# EAGLE board quantum_AnalougeEngine_V4_0 (EAGLE 9.5.2)
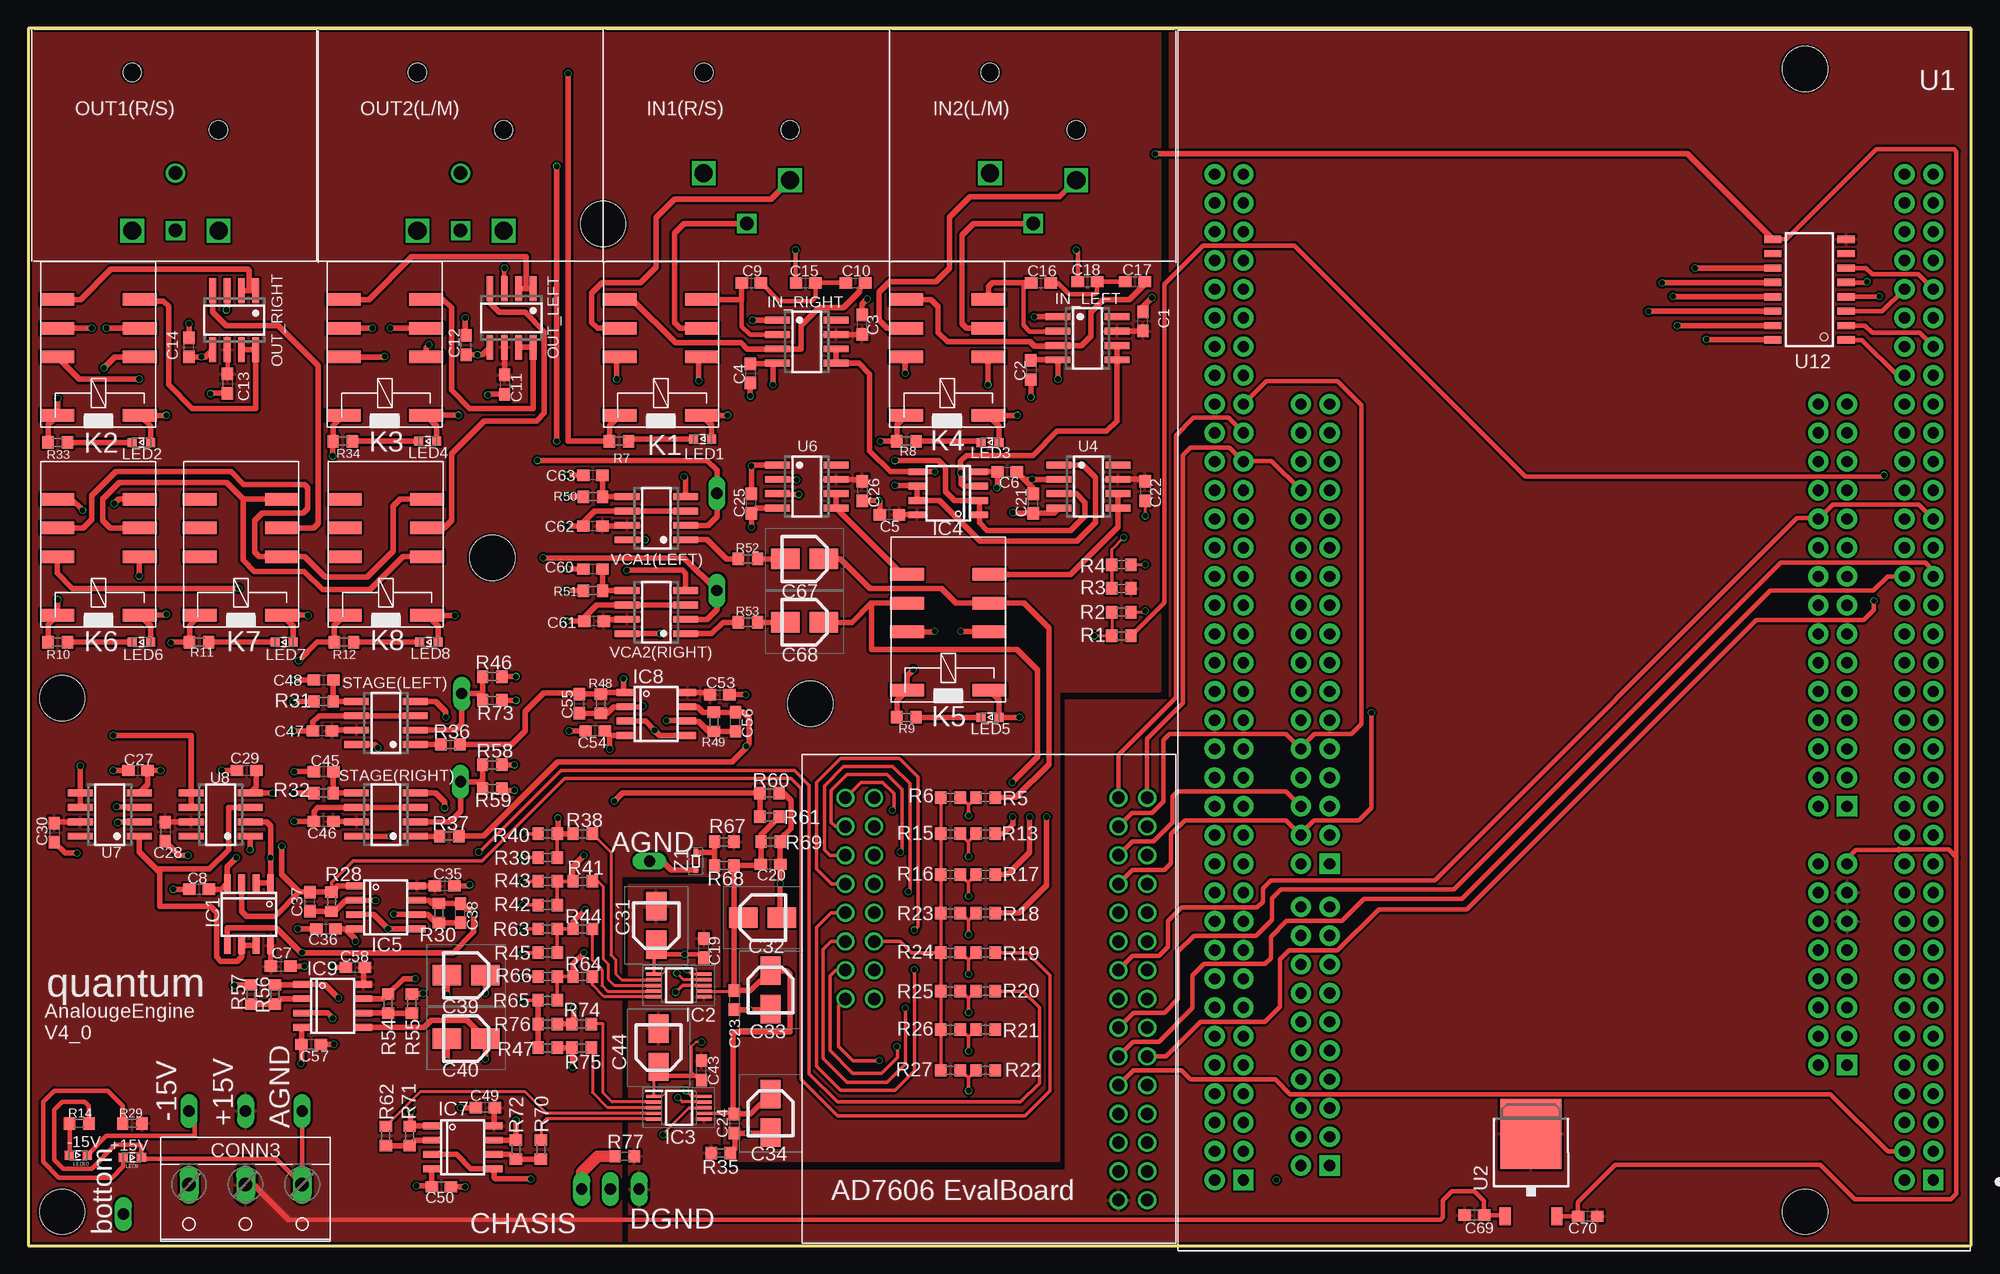
[diagram p11: board, top side]
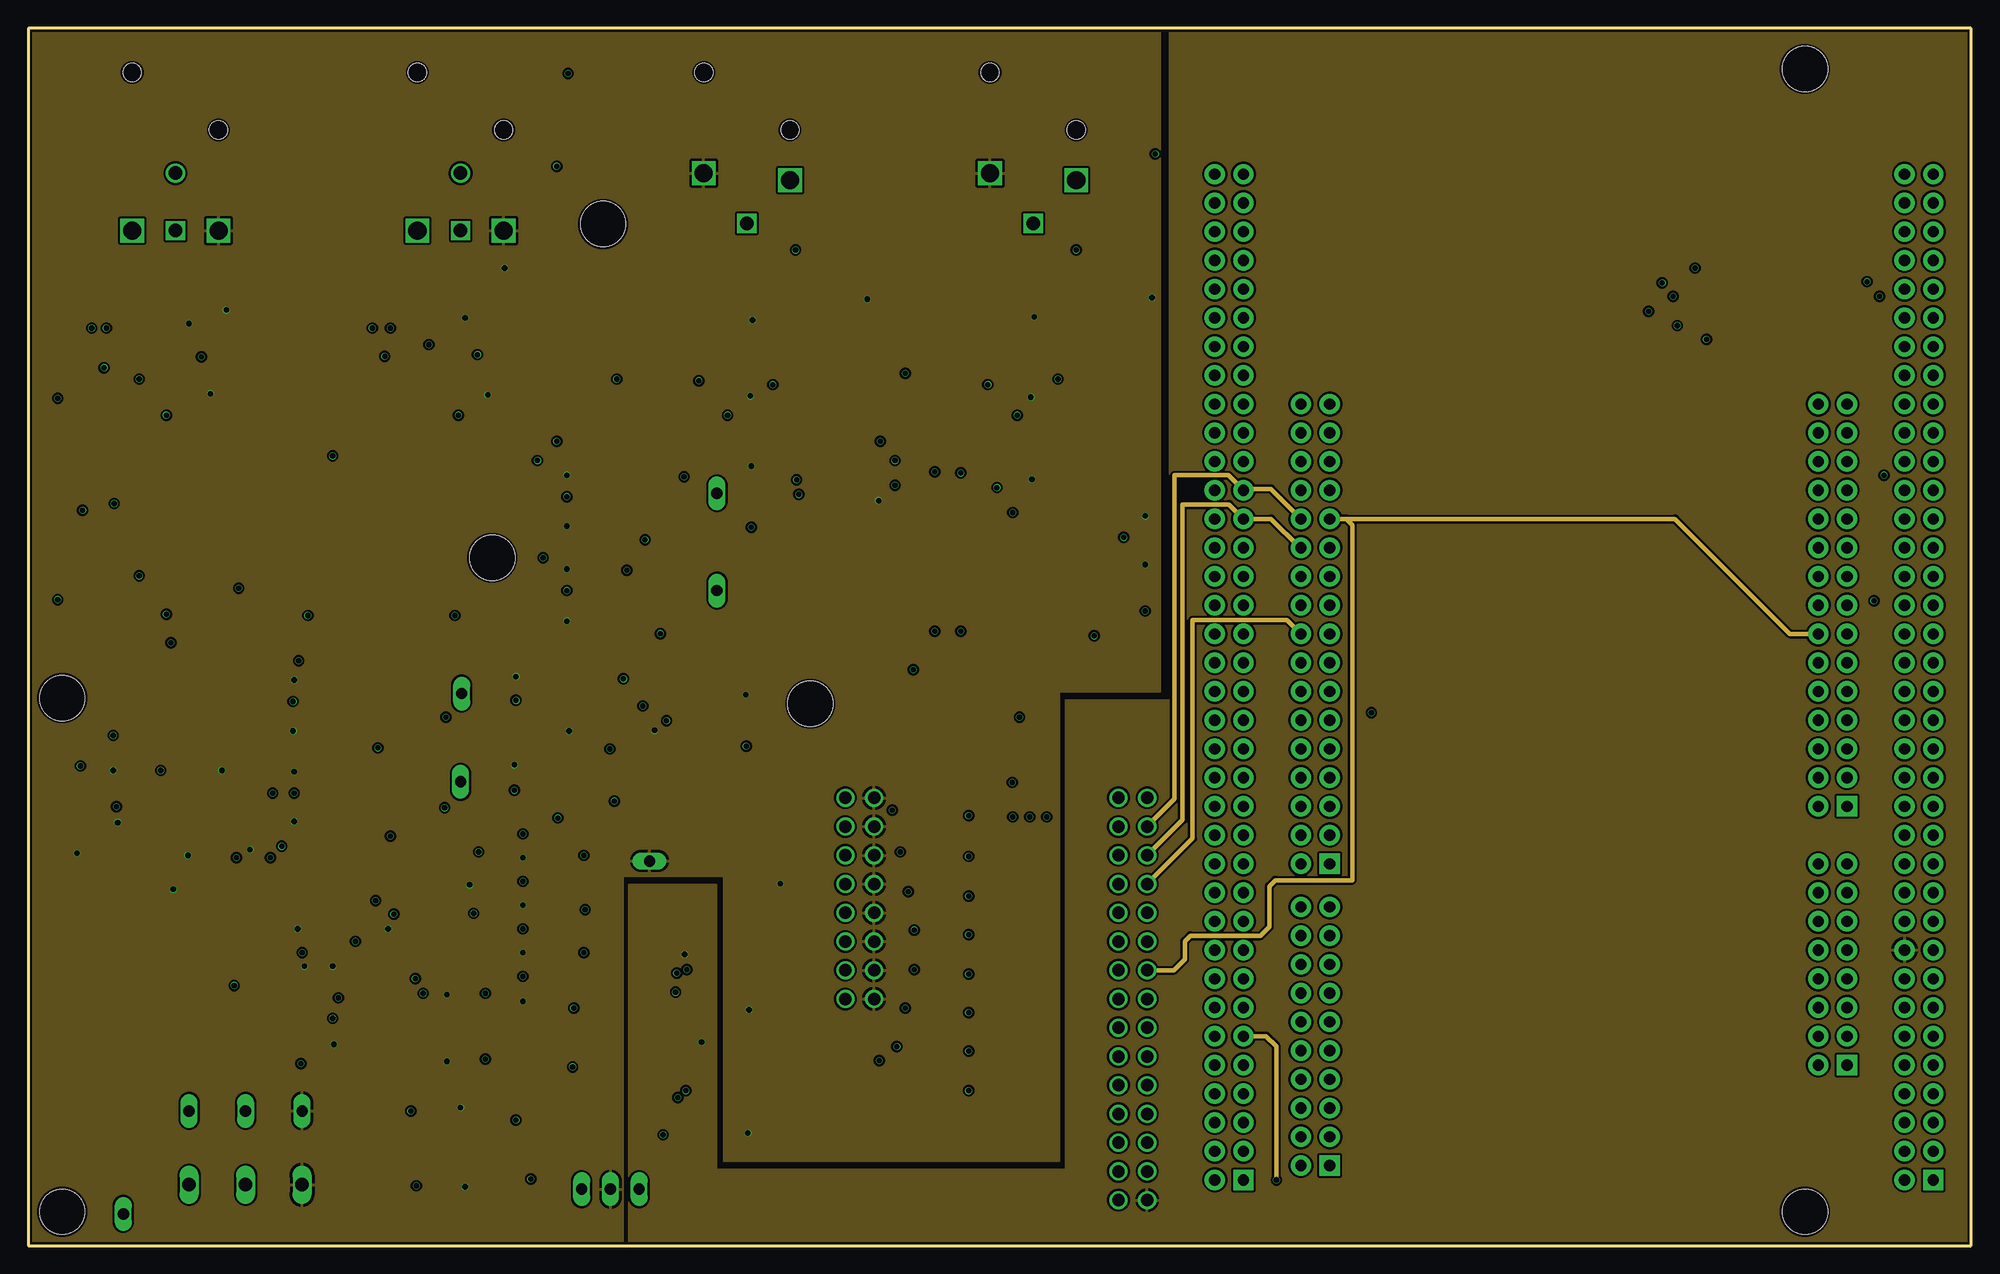
[diagram p12: board, inner layer midTop(AGND)]
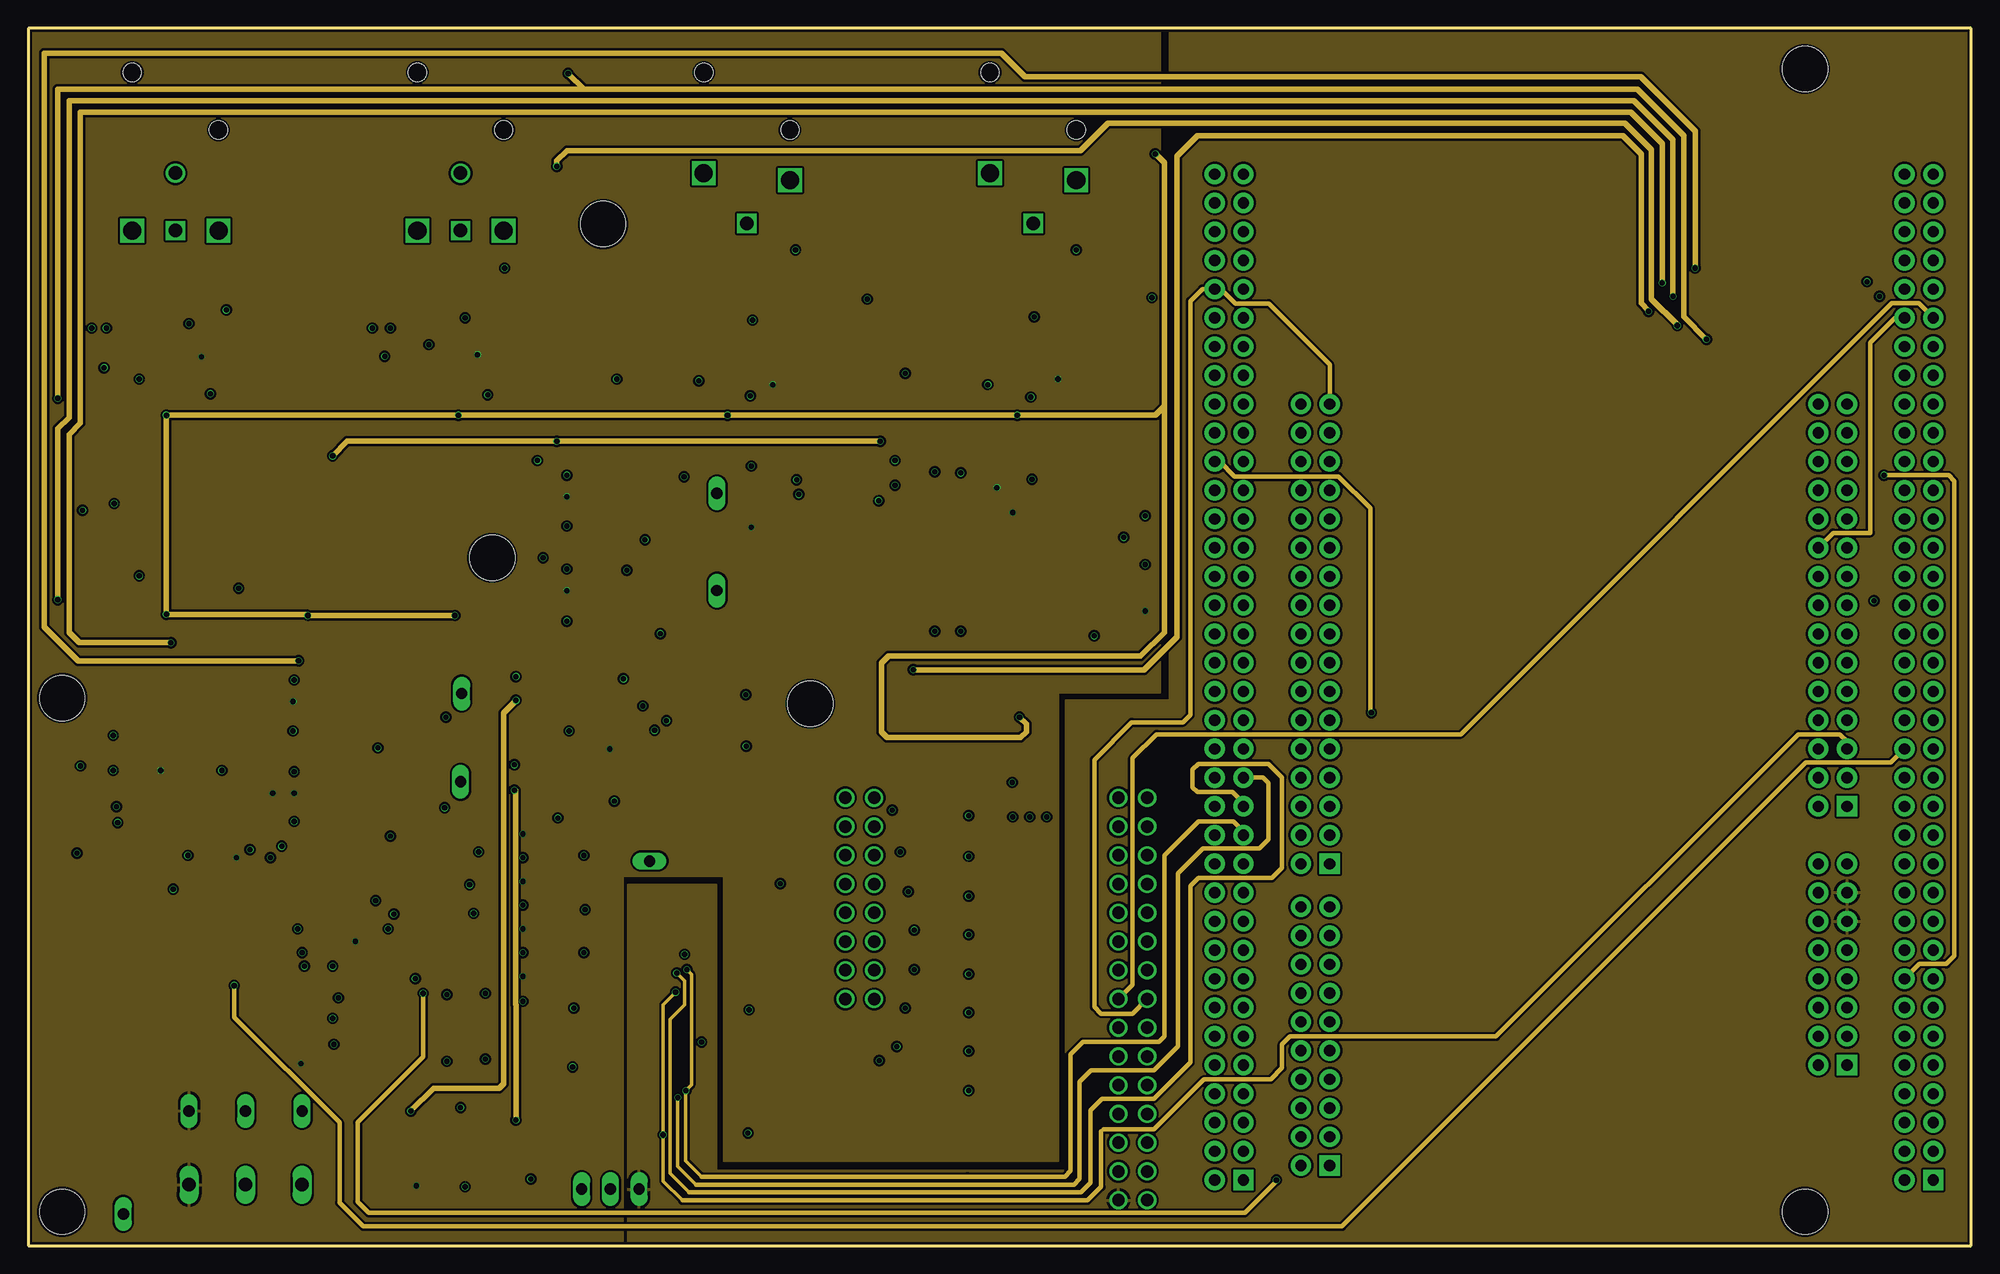
[diagram p13: board, inner layer midBottom(V-)]
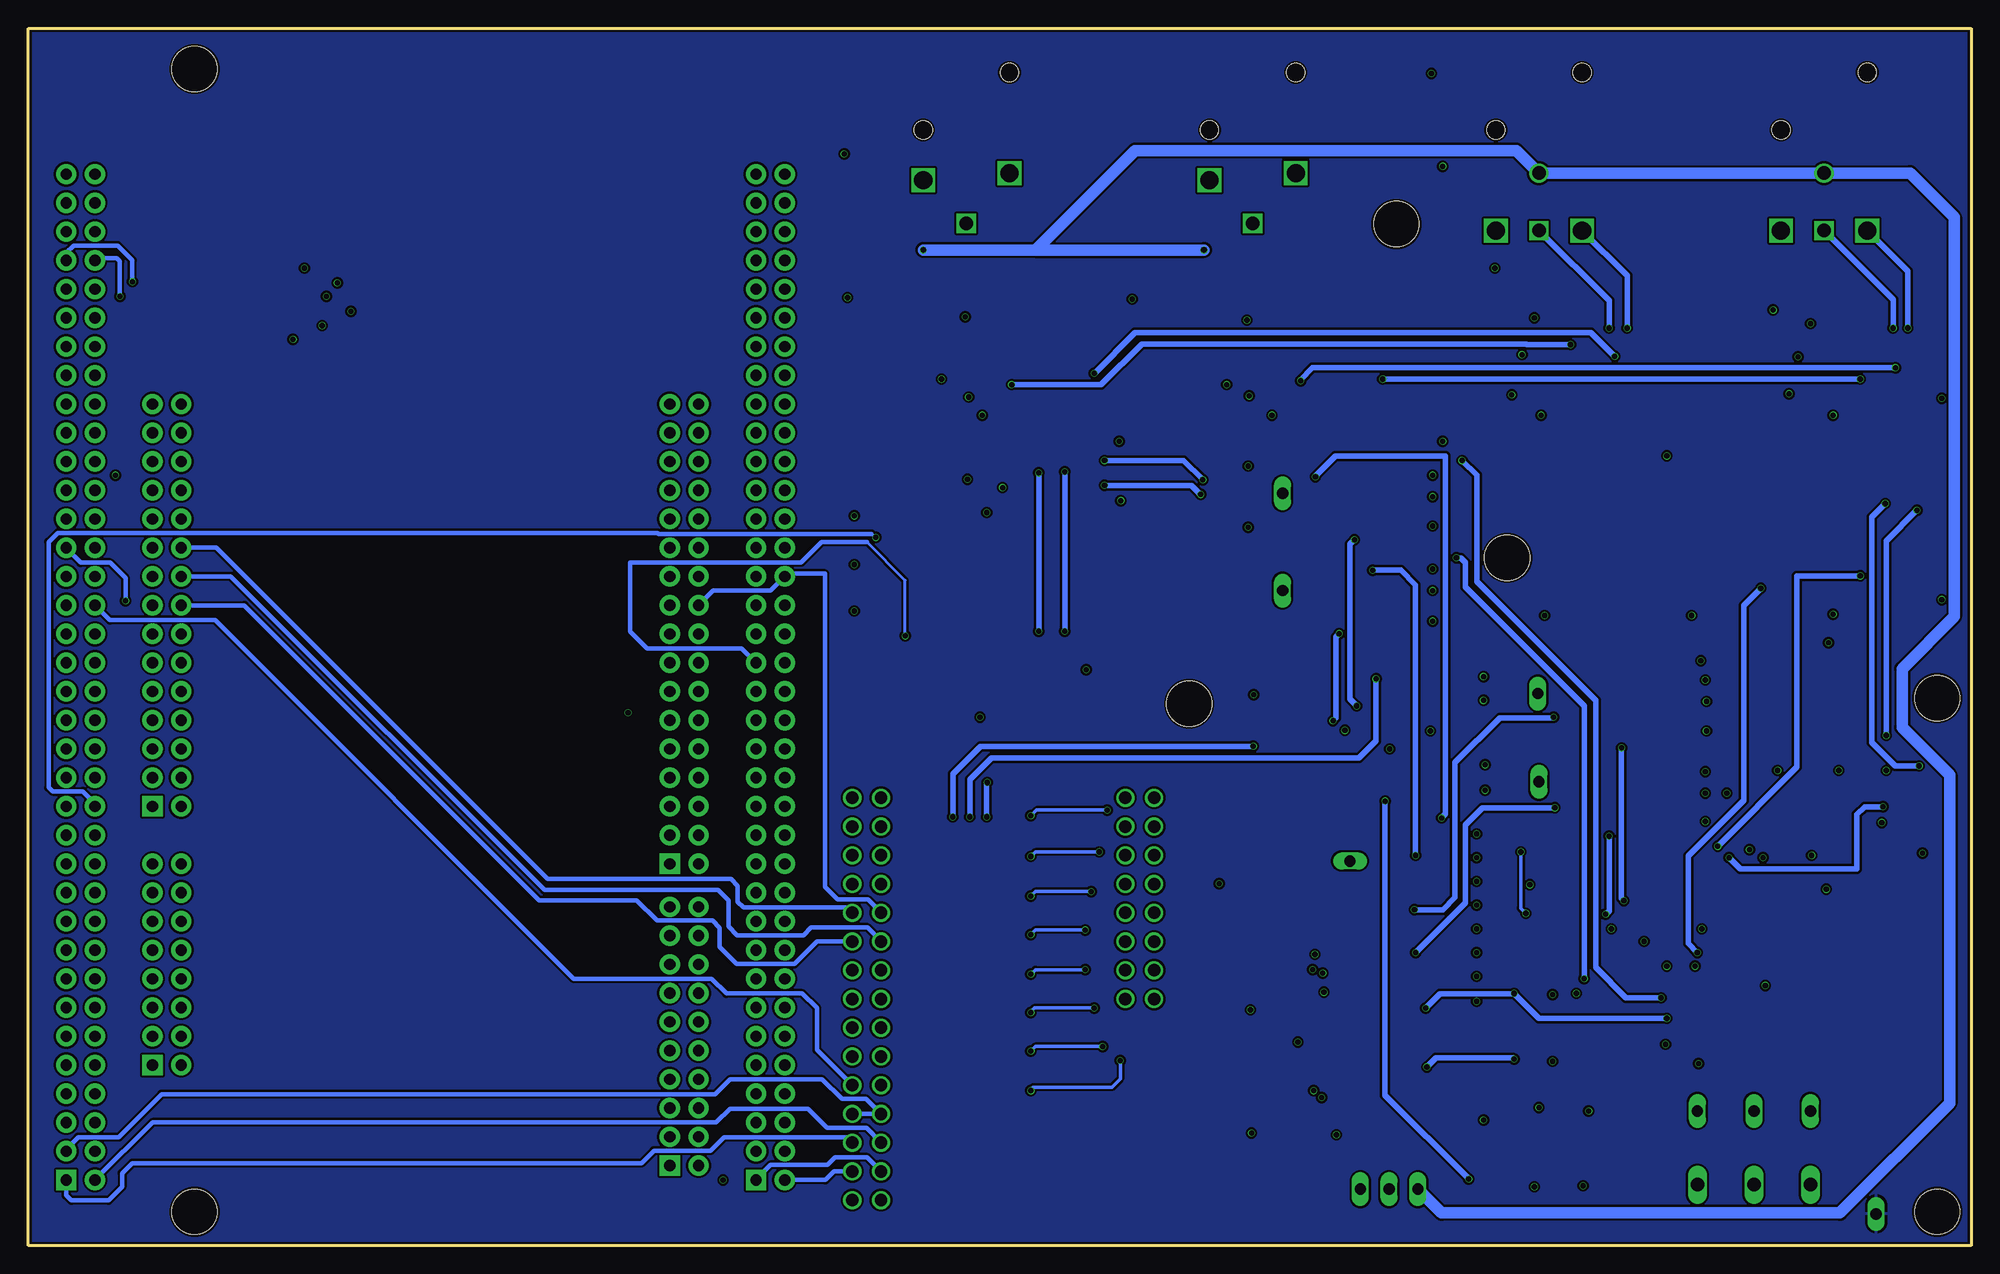
[diagram p14: board, bottom side, seen from below]

Size 171.7 x 107.6 mm. Coordinates in mm from the lower left corner, seen from the top.
Outline: 0,0 171.7,0 171.7,107.6 0,107.6 0,0
Copper layers (1*2+15*16): Top(V+) 0.018mm / dielectric 0.362mm / midTop(AGND) 0.035mm / dielectric 0.71mm / midBottom(V-) 0.035mm / dielectric 0.362mm / Bottom 0.018mm
Design rules "4layer": minimum track width 0.2mm, minimum drill 0.2mm, track to track 0.2mm, track to pad 0.1mm, pad to pad 0.1mm, via to via 0.1mm, smd to smd 0.1mm, copper to edge 0.2mm, drill to drill 0.21mm, minimum pad ring 0.25mm, minimum via ring 0.05mm, stop-mask expansion 0.01mm, vias tented up to drill 0mil, thermal gap 10mil
Holes 4 mm at 3,3 157,3 69.1,47.9 157,104 50.8,90.3 41,60.8 3,48.4

## Footprints (pad centres in the part's own frame; a part is rotated, then mirrored left to right if it is on the bottom)
C0603 = smd 1.1 x 1: 1 -0.85,0; 2 0.85,0
CAPAE400X550N = smd 2.5 x 1.8: 1 -1.7,0; 2 1.7,0
W237-103 = drill 1.194 long: 1 -5,-1.29; 2 0,-1.29; 3 5,-1.29
SOIC8 = smd 0.6 x 1.5: 1 -1.905,-2.75; 2 -0.635,-2.75; 3 0.635,-2.75; 4 1.905,-2.75; 5 1.905,2.75; 6 0.635,2.75; 7 -0.635,2.75; 8 -1.905,2.75
SOP50P490X110-10N = smd 1.4 x 0.3: 1 -2.2,1; 2 -2.2,0.5; 3 -2.2,0; 4 -2.2,-0.5; 5 -2.2,-1; 6 2.2,-1; 7 2.2,-0.5; 8 2.2,0; 9 2.2,0.5; 10 2.2,1
NEUTRIK_NC3FAH = drill 1.6 square: 1 -3.81,-12.7; 2 3.81,-13.335 | drill 1.2 square: 3 0,-17.15 | hole 1.6: -3.81,-3.81; 3.81,-8.89
SO08 = smd 0.6 x 2.2: 1 -1.905,-2.6; 2 -0.635,-2.6; 3 0.635,-2.6; 4 1.905,-2.6; 5 1.905,2.6; 6 0.635,2.6; 7 -0.635,2.6; 8 -1.905,2.6
351 = smd 1.11 x 3: 1 -2.623,-3.645; 2 -2.623,3.645; P1 5.096,-3.645; P2 5.096,3.645; Q1 2.556,-3.645; Q2 2.556,3.645; S1 7.636,-3.645; S2 7.636,3.645
WL-SMCW_0603 = smd 0.8 x 0.8: 1 -0.8,0; 2 0.8,0
NEUTRIK_NC3MAH = drill 1.6 square: 1 3.81,-17.78; 2 -3.81,-17.78 | drill 1.2 square: 3 0,-17.78 | drill 1.2: G 0,-12.7 | hole 1.6: -3.81,-3.8; 3.81,-8.89
R0603 = smd 1 x 1.1: 1 -0.85,0; 2 0.85,0
THT_PIN = drill 1 long: P$1 0,0
MODULE_NUCLEO-F429ZI = drill 1 pad 1.8 square: CN7_1 21.59,43.82; CN8_1 -24.13,34.93; CN9_1 -24.13,12.07; CN10_1 21.59,17.15; CN11_1 -31.75,45.09; CN12_1 29.21,45.09 | drill 1 pad 1.8: CN7_2 24.13,43.82; CN7_3 21.59,41.28; CN7_4 24.13,41.28; CN7_5 21.59,38.74; CN7_6 24.13,38.74; CN7_7 21.59,36.2; CN7_8 24.13,36.2; CN7_9 21.59,33.66; CN7_10 24.13,33.66; CN7_11 21.59,31.12; CN7_12 24.13,31.12; CN7_13 21.59,28.58; CN7_14 24.13,28.58; CN7_15 21.59,26.04; CN7_16 24.13,26.04; CN7_17 21.59,23.5; CN7_18 24.13,23.5; CN7_19 21.59,20.96; CN7_20 24.13,20.96; CN8_2 -21.59,34.93; CN8_3 -24.13,32.39; CN8_4 -21.59,32.39; CN8_5 -24.13,29.85; CN8_6 -21.59,29.85; CN8_7 -24.13,27.31; CN8_8 -21.59,27.31; CN8_9 -24.13,24.77; CN8_10 -21.59,24.77; CN8_11 -24.13,22.23; CN8_12 -21.59,22.23; CN8_13 -24.13,19.69; CN8_14 -21.59,19.69; CN8_15 -24.13,17.15; CN8_16 -21.59,17.15; CN9_2 -21.59,12.07; CN9_3 -24.13,9.53; CN9_4 -21.59,9.53; CN9_5 -24.13,6.99; CN9_6 -21.59,6.99; CN9_7 -24.13,4.45; CN9_8 -21.59,4.45; CN9_9 -24.13,1.91; CN9_10 -21.59,1.91; CN9_11 -24.13,-0.63; CN9_12 -21.59,-0.63; CN9_13 -24.13,-3.17; CN9_14 -21.59,-3.17; CN9_15 -24.13,-5.71; CN9_16 -21.59,-5.71; CN9_17 -24.13,-8.25; CN9_18 -21.59,-8.25; CN9_19 -24.13,-10.79; CN9_20 -21.59,-10.79; CN9_21 -24.13,-13.33; CN9_22 -21.59,-13.33; CN9_23 -24.13,-15.87; CN9_24 -21.59,-15.87; CN9_25 -24.13,-18.41; CN9_26 -21.59,-18.41; CN9_27 -24.13,-20.95; CN9_28 -21.59,-20.95; CN9_29 -24.13,-23.49; CN9_30 -21.59,-23.49; CN10_2 24.13,17.15; CN10_3 21.59,14.61; CN10_4 24.13,14.61; CN10_5 21.59,12.07; CN10_6 24.13,12.07; CN10_7 21.59,9.53; CN10_8 24.13,9.53; CN10_9 21.59,6.99; CN10_10 24.13,6.99; CN10_11 21.59,4.45; CN10_12 24.13,4.45; CN10_13 21.59,1.91; CN10_14 24.13,1.91; CN10_15 21.59,-0.63; CN10_16 24.13,-0.63; CN10_17 21.59,-3.17; CN10_18 24.13,-3.17; CN10_19 21.59,-5.71; CN10_20 24.13,-5.71; CN10_21 21.59,-8.25; CN10_22 24.13,-8.25; CN10_23 21.59,-10.79; CN10_24 24.13,-10.79; CN10_25 21.59,-13.33; CN10_26 24.13,-13.33; CN10_27 21.59,-15.87; CN10_28 24.13,-15.87; CN10_29 21.59,-18.41; CN10_30 24.13,-18.41; CN10_31 21.59,-20.95; CN10_32 24.13,-20.95; CN10_33 21.59,-23.49; CN10_34 24.13,-23.49; CN11_2 -29.21,45.09; CN11_3 -31.75,42.55; CN11_4 -29.21,42.55; CN11_5 -31.75,40.01; CN11_6 -29.21,40.01; CN11_7 -31.75,37.47; CN11_8 -29.21,37.47; CN11_9 -31.75,34.93; CN11_10 -29.21,34.93; CN11_11 -31.75,32.39; CN11_12 -29.21,32.39; CN11_13 -31.75,29.85; CN11_14 -29.21,29.85; CN11_15 -31.75,27.31; CN11_16 -29.21,27.31; CN11_17 -31.75,24.77; CN11_18 -29.21,24.77; CN11_19 -31.75,22.23; CN11_20 -29.21,22.23; CN11_21 -31.75,19.69; CN11_22 -29.21,19.69; CN11_23 -31.75,17.15; CN11_24 -29.21,17.15; CN11_25 -31.75,14.61; CN11_26 -29.21,14.61; CN11_27 -31.75,12.07; CN11_28 -29.21,12.07; CN11_29 -31.75,9.53; CN11_30 -29.21,9.53; CN11_31 -31.75,6.99; CN11_32 -29.21,6.99; CN11_33 -31.75,4.45; CN11_34 -29.21,4.45; CN11_35 -31.75,1.91; CN11_36 -29.21,1.91; CN11_37 -31.75,-0.63; CN11_38 -29.21,-0.63; CN11_39 -31.75,-3.17; CN11_40 -29.21,-3.17; CN11_41 -31.75,-5.71; CN11_42 -29.21,-5.71; CN11_43 -31.75,-8.25; CN11_44 -29.21,-8.25; CN11_45 -31.75,-10.79; CN11_46 -29.21,-10.79; CN11_47 -31.75,-13.33; CN11_48 -29.21,-13.33; CN11_49 -31.75,-15.87; CN11_50 -29.21,-15.87; CN11_51 -31.75,-18.41; CN11_52 -29.21,-18.41; CN11_53 -31.75,-20.95; CN11_54 -29.21,-20.95; CN11_55 -31.75,-23.49; CN11_56 -29.21,-23.49; CN11_57 -31.75,-26.03; CN11_58 -29.21,-26.03; CN11_59 -31.75,-28.57; CN11_60 -29.21,-28.57; CN11_61 -31.75,-31.11; CN11_62 -29.21,-31.11; CN11_63 -31.75,-33.65; CN11_64 -29.21,-33.65; CN11_65 -31.75,-36.19; CN11_66 -29.21,-36.19; CN11_67 -31.75,-38.73; CN11_68 -29.21,-38.73; CN11_69 -31.75,-41.27; CN11_70 -29.21,-41.27; CN11_71 -31.75,-43.81; CN11_72 -29.21,-43.81; CN12_2 31.75,45.09; CN12_3 29.21,42.55; CN12_4 31.75,42.55; CN12_5 29.21,40.01; CN12_6 31.75,40.01; CN12_7 29.21,37.47; CN12_8 31.75,37.47; CN12_9 29.21,34.93; CN12_10 31.75,34.93; CN12_11 29.21,32.39; CN12_12 31.75,32.39; CN12_13 29.21,29.85; CN12_14 31.75,29.85; CN12_15 29.21,27.31; CN12_16 31.75,27.31; CN12_17 29.21,24.77; CN12_18 31.75,24.77; CN12_19 29.21,22.23; CN12_20 31.75,22.23; CN12_21 29.21,19.69; CN12_22 31.75,19.69; CN12_23 29.21,17.15; CN12_24 31.75,17.15; CN12_25 29.21,14.61; CN12_26 31.75,14.61; CN12_27 29.21,12.07; CN12_28 31.75,12.07; CN12_29 29.21,9.53; CN12_30 31.75,9.53; CN12_31 29.21,6.99; CN12_32 31.75,6.99; CN12_33 29.21,4.45; CN12_34 31.75,4.45; CN12_35 29.21,1.91; CN12_36 31.75,1.91; CN12_37 29.21,-0.63; CN12_38 31.75,-0.63; CN12_39 29.21,-3.17; CN12_40 31.75,-3.17; CN12_41 29.21,-5.71; CN12_42 31.75,-5.71; CN12_43 29.21,-8.25; CN12_44 31.75,-8.25; CN12_45 29.21,-10.79; CN12_46 31.75,-10.79; CN12_47 29.21,-13.33; CN12_48 31.75,-13.33; CN12_49 29.21,-15.87; CN12_50 31.75,-15.87; CN12_51 29.21,-18.41; CN12_52 31.75,-18.41; CN12_53 29.21,-20.95; CN12_54 31.75,-20.95; CN12_55 29.21,-23.49; CN12_56 31.75,-23.49; CN12_57 29.21,-26.03; CN12_58 31.75,-26.03; CN12_59 29.21,-28.57; CN12_60 31.75,-28.57; CN12_61 29.21,-31.11; CN12_62 31.75,-31.11; CN12_63 29.21,-33.65; CN12_64 31.75,-33.65; CN12_65 29.21,-36.19; CN12_66 31.75,-36.19; CN12_67 29.21,-38.73; CN12_68 31.75,-38.73; CN12_69 29.21,-41.27; CN12_70 31.75,-41.27; CN12_71 29.21,-43.81; CN12_72 31.75,-43.81
TO252 = smd 1 x 1.6: 1 -2.28,-4.8; 3 2.28,-4.8 | smd 5.4 x 6.2: 2 0,2.5
AD7606_EVALBOARD = drill 1.1: +5V 30.48,-39.37; BUSY 27.94,-26.67; CS 30.48,-26.67; CVA 30.48,-31.75; CVB 27.94,-31.75; DB0 30.48,-21.59; DB1 27.94,-21.59; DB2 30.48,-19.05; DB3 27.94,-19.05; DB4 30.48,-16.51; DB5 27.94,-16.51; DB6 30.48,-13.97; DB7 27.94,-13.97; DB8 30.48,-11.43; DB9 27.94,-11.43; DB10 30.48,-8.89; DB11 27.94,-8.89; DB12 30.48,-6.35; DB13 27.94,-6.35; DB14 30.48,-3.81; DB15 27.94,-3.81; FRST 27.94,-24.13; G1 6.35,-3.81; G2 6.35,-6.35; G3 6.35,-8.89; G4 6.35,-11.43; G5 6.35,-13.97; G6 6.35,-16.51; G7 6.35,-19.05; G8 6.35,-21.59; GND 27.94,-39.37; OS0 30.48,-36.83; OS1 27.94,-36.83; OS2 30.48,-34.29; RANGE 27.94,-34.29; RD 27.94,-29.21; RST 30.48,-29.21; V1 3.81,-3.81; V2 3.81,-6.35; V3 3.81,-8.89; V4 3.81,-11.43; V5 3.81,-13.97; V6 3.81,-16.51; V7 3.81,-19.05; V8 3.81,-21.59; VIO 30.48,-24.13
SOIC16 = smd 1.524 x 0.635: 1 -3.24,4.445; 2 -3.24,3.175; 3 -3.24,1.905; 4 -3.24,0.635; 5 -3.24,-0.635; 6 -3.24,-1.905; 7 -3.24,-3.175; 8 -3.24,-4.445; 9 3.24,-4.445; 10 3.24,-3.175; 11 3.24,-1.905; 12 3.24,-0.635; 13 3.24,0.635; 14 3.24,1.905; 15 3.24,3.175; 16 3.24,4.445
SODFL1608X65N = smd 0.57 x 0.42: 1 -0.775,0; 2 0.775,0

## Placement (x,y rotation side)
C1  100nF  [C0603]  98.5,81.7 90 top
C2  100nF  [C0603]  88.6,77.4 270 top
C3  100nF  [C0603]  73.7,81.4 90 top
C4  100nF  [C0603]  63.8,77.1 270 top
C5  100nF  [C0603]  76.1,64.6 180 top
C6  100nF  [C0603]  86.5,68.4 0 top
C7  100nF  [C0603]  22.3,24.7 0 top
C8  100nF  [C0603]  15.1,31.5 180 top
C9  470 pF  [C0603]  63.9,85.1 0 top
C10  470 pF  [C0603]  73.1,85.1 0 top
C11  100nF  [C0603]  42.1,76.1 270 top
C12  100nF  [C0603]  38.7,79.6 90 top
C13  100nF  [C0603]  17.6,76.2 270 top
C14  100nF  [C0603]  14.2,79.4 90 top
C15  47 pF  [C0603]  68.7,85.1 0 top
C16  470 pF  [C0603]  89.5,85.1 0 top
C17  470 pF  [C0603]  97.8,85.2 0 top
C18  47 pF  [C0603]  93.6,85.2 0 top
C19  100nF  [C0603]  59.7,26.3 90 top
C20  100nF  [C0603]  65.6,33.7 0 top
C21  100nF  [C0603]  88.8,65.6 90 top
C22  100nF  [C0603]  98.7,66.7 270 top
C23  100nF  [C0603]  62.4,21.7 270 top
C24  100nF  [C0603]  62.4,10.8 270 top
C25  100nF  [C0603]  63.9,65.6 90 top
C26  100nF  [C0603]  73.7,66.7 270 top
C27  100nF  [C0603]  9.7,42 180 top
C28  100nF  [C0603]  12.1,36.6 270 top
C29  100nF  [C0603]  19.3,42 180 top
C30  100nF  [C0603]  2.3,36.5 270 top
C31  10 µF  [CAPAE400X550N]  55.5,28.3 90 top
C32  10 µF  [CAPAE400X550N]  64.9,29 0 top
C33  10 µF  [CAPAE400X550N]  65.6,22.6 270 top
C34  10 µF  [CAPAE400X550N]  65.6,11.7 270 top
C35  100nF  [C0603]  36.8,31.8 0 top
C36  100nF  [C0603]  26.3,28 180 top
C37  22pF  [C0603]  24.9,30.4 90 top
C38  22pF  [C0603]  38.2,29.4 90 top
C39  10 µF  [CAPAE400X550N]  38.7,23.9 180 top
C40  10 µF  [CAPAE400X550N]  38.7,18.3 180 top
C43  100nF  [C0603]  59.5,15.5 90 top
C44  10 µF  [CAPAE400X550N]  55.7,17.5 90 top
C45  100nF  [C0603]  26.1,41.9 180 top
C46  100nF  [C0603]  26.1,37.5 180 top
C47  100nF  [C0603]  26,45.5 180 top
C48  100nF  [C0603]  26.1,50 180 top
C49  100nF  [C0603]  40.4,12.2 180 top
C50  100nF  [C0603]  36.5,5.2 0 top
C53  100nF  [C0603]  61.1,48.7 0 top
C54  100nF  [C0603]  50.1,45.5 180 top
C55  22pF  [C0603]  48.7,47.9 90 top
C56  22pF  [C0603]  62.5,46.3 90 top
C57  100nF  [C0603]  25,17.8 0 top
C58  100nF  [C0603]  28.9,24.6 180 top
C60  100nF  [C0603]  49.9,59.8 180 top
C61  100nF  [C0603]  50,55.2 180 top
C62  100nF  [C0603]  49.9,63.6 180 top
C63  100nF  [C0603]  49.9,68.1 180 top
C67  47µF  [CAPAE400X550N]  68.6,60.7 180 top
C68  47µF  [CAPAE400X550N]  68.6,55.1 180 top
C69  0.33 uF  [C0603]  127.8,2.7 180 top
C70  100 nF  [C0603]  137.8,2.6 0 top
CONN3  [W237-103]  19.2,4.1 180 top
IC1  OP275  [SOIC8]  19.5,29.3 180 top
IC2  DAC084S085CIMM_NOPB  [SOP50P490X110-10N]  57.5,23 0 top
IC3  DAC084S085CIMM_NOPB  [SOP50P490X110-10N]  57.5,12.2 0 top
IC4  OP275  [SOIC8]  81.3,66.5 90 top
IC5  OP275  [SOIC8]  31.6,29.9 270 top
IC7  TL072  [SOIC8]  38.4,8.7 270 top
IC8  OP275  [SOIC8]  55.5,47 270 top
IC9  TL072  [SOIC8]  26.9,21.2 270 top
IN1(R/S)  NEUTRIK_NC3FAH  [NEUTRIK_NC3FAH]  63.5,107.5 0 top
IN2(L/M)  NEUTRIK_NC3FAH  [NEUTRIK_NC3FAH]  88.8,107.5 0 top
IN_LEFT  1240  [SO08]  93.6,80.2 270 top
IN_RIGHT  1240  [SO08]  68.8,79.9 270 top
K1  K1  [351]  55.9,76 90 top
K2  K2  [351]  6.2,76 90 top
K3  K3  [351]  31.5,76 90 top
K4  K4  [351]  81.2,76 90 top
K5  K5  [351]  81.3,51.7 90 top
K6  K6  [351]  6.2,58.35 90 top
K7  K7  [351]  18.8,58.35 90 top
K8  K8  [351]  31.6,58.35 90 top
LED1  LED_BLUE_SMD  [WL-SMCW_0603]  59.6,71.3 0 top
LED2  LED_BLUE_SMD  [WL-SMCW_0603]  10,71 0 top
LED3  LED_BLUE_SMD  [WL-SMCW_0603]  85,71 0 top
LED4  LED_BLUE_SMD  [WL-SMCW_0603]  35.3,71.1 0 top
LED5  LED_BLUE_SMD  [WL-SMCW_0603]  85,46.7 0 top
LED6  LED_BLUE_SMD  [WL-SMCW_0603]  10,53.35 0 top
LED7  LED_BLUE_SMD  [WL-SMCW_0603]  22.6,53.35 0 top
LED8  LED_BLUE_SMD  [WL-SMCW_0603]  35.4,53.35 0 top
LED9  LED_GREEN_SMD  [WL-SMCW_0603]  9.2,7.8 180 top
LED10  LED_GREEN_SMD  [WL-SMCW_0603]  4.4,8 180 top
OUT1(R/S)  NEUTRIK_NC3MAH  [NEUTRIK_NC3MAH]  13,107.5 0 top
OUT2(L/M)  NEUTRIK_NC3MAH  [NEUTRIK_NC3MAH]  38.2,107.5 0 top
OUT_LEFT  1646  [SO08]  42.7,82 180 top
OUT_RIGHT  1646  [SO08]  18.2,81.8 180 top
R1  10k  [R0603]  96.6,53.9 0 top
R2  100k  [R0603]  96.6,56 180 top
R3  100k  [R0603]  96.6,58.1 0 top
R4  10k  [R0603]  96.6,60.2 180 top
R5  10k  [R0603]  84.6,39.6 180 top
R6  10k  [R0603]  81.5,39.6 0 top
R7  470R  [R0603]  52.2,71.1 0 top
R8  470R  [R0603]  77.6,71.1 0 top
R9  470R  [R0603]  77.6,46.7 0 top
R10  470R  [R0603]  2.6,53.35 0 top
R11  470R  [R0603]  15.1,53.35 0 top
R12  470R  [R0603]  27.9,53.35 0 top
R13  10k  [R0603]  84.6,36.4 180 top
R14  220R  [R0603]  4.5,10.8 0 top
R15  10k  [R0603]  81.5,36.4 0 top
R16  10k  [R0603]  81.5,32.8 0 top
R17  10k  [R0603]  84.6,32.8 180 top
R18  10k  [R0603]  84.6,29.4 180 top
R19  10k  [R0603]  84.6,25.9 180 top
R20  10k  [R0603]  84.6,22.5 180 top
R21  10k  [R0603]  84.6,19.1 180 top
R22  10k  [R0603]  84.6,15.5 180 top
R23  10k  [R0603]  81.5,29.4 0 top
R24  10k  [R0603]  81.5,25.9 0 top
R25  10k  [R0603]  81.5,22.5 0 top
R26  10k  [R0603]  81.5,19.1 0 top
R27  10k  [R0603]  81.5,15.5 0 top
R28  20k  [R0603]  26.8,30.4 90 top
R29  220R  [R0603]  9.2,10.8 0 top
R30  20k  [R0603]  36.3,29.4 90 top
R31  5k1  [R0603]  26.1,48.1 0 top
R32  5k1  [R0603]  26.1,40 0 top
R33  470R  [R0603]  2.6,71 0 top
R34  470R  [R0603]  27.8,71.1 0 top
R35  0R  [R0603]  61.2,8.2 180 top
R36  20k  [R0603]  37.3,44.3 180 top
R37  20k  [R0603]  37.2,36.2 180 top
R38  51k  [R0603]  49,36.4 0 top
R39  51R  [R0603]  45.9,34.3 0 top
R40  90k9  [R0603]  45.9,36.4 0 top
R41  51k  [R0603]  49,32.2 0 top
R42  51R  [R0603]  45.9,30.1 0 top
R43  90k9  [R0603]  45.9,32.2 0 top
R44  51k  [R0603]  49,28 0 top
R45  51R  [R0603]  45.9,25.9 0 top
R46  10k  [R0603]  41,50.3 180 top
R47  1k8  [R0603]  45.9,17.5 0 top
R48  20k  [R0603]  50.6,47.9 90 top
R49  20k  [R0603]  60.6,46.3 90 top
R50  5k1  [R0603]  49.9,66.2 0 top
R51  5k1  [R0603]  49.9,57.9 0 top
R52  20k  [R0603]  63.6,60.7 180 top
R53  20k  [R0603]  63.6,55.1 180 top
R54  10k  [R0603]  31.8,21.4 90 top
R55  10k  [R0603]  33.9,21.4 270 top
R56  10k  [R0603]  21.8,22.2 90 top
R57  10k  [R0603]  19.7,22.2 270 top
R58  10k  [R0603]  41,42.5 180 top
R59  56k  [R0603]  41,40.4 0 top
R60  10k  [R0603]  65.5,40 180 top
R61  10k  [R0603]  65.5,37.9 0 top
R62  10k  [R0603]  31.6,9.7 270 top
R63  90k9  [R0603]  45.9,28 0 top
R64  51k  [R0603]  49,23.8 0 top
R65  51R  [R0603]  45.9,21.7 0 top
R66  90k9  [R0603]  45.9,23.8 0 top
R67  10k  [R0603]  61.5,35.7 0 top
R68  10k  [R0603]  61.5,33.6 180 top
R69  10k  [R0603]  65.6,35.7 180 top
R70  10k  [R0603]  45.3,8.5 270 top
R71  10k  [R0603]  33.7,9.7 90 top
R72  10k  [R0603]  43.1,8.5 90 top
R73  10k  [R0603]  41,48.2 0 top
R74  10k  [R0603]  48.9,19.6 180 top
R75  10k  [R0603]  48.9,17.5 180 top
R76  1k8  [R0603]  45.9,19.6 0 top
R77  0R  [R0603]  52.7,7.9 0 top
STAGE(LEFT)  THAT2181SO8-US  [SO08]  31.6,46.2 90 top
STAGE(RIGHT)  THAT2181SO8-US  [SO08]  31.6,38.1 90 top
TP01  TPTHT  [THT_PIN]  38.2,41 90 top
TP02  TPTHT  [THT_PIN]  38.3,48.8 90 top
TP03  TPTHT  [THT_PIN]  48.9,5 90 top
TP04  TPTHT  [THT_PIN]  24.2,11.9 90 top
TP05  TPTHT  [THT_PIN]  53.98,5 90 top
TP06  TPTHT  [THT_PIN]  8.4,2.8 90 top
TP09  TPTHT  [THT_PIN]  19.2,11.9 270 top
TP16  TPTHT  [THT_PIN]  54.9,34 0 top
TP18  TPTHT  [THT_PIN]  51.44,5 90 top
TP23  TPTHT  [THT_PIN]  14.2,11.9 90 top
TP36  TPTHT  [THT_PIN]  60.85,57.9 90 top
TP37  TPTHT  [THT_PIN]  60.85,66.5 90 top
U1  NUCLEO-F429ZI  [MODULE_NUCLEO-F429ZI]  136.6,50.9 180 top
U2  7812  [TO252]  132.8,7.4 0 top
U3  AD7606_EVALBOARD  [AD7606_EVALBOARD]  68.4,43.4 0 top
U4  THAT1240  [SO08]  93.7,67.1 270 top
U6  THAT1240  [SO08]  68.8,67.1 270 top
U7  THAT1240  [SO08]  7.2,38.1 90 top
U8  THAT1240  [SO08]  17,38.1 90 top
U12  ULN2003  [SOIC16]  157.4,84.5 180 top
VCA1(LEFT)  THAT2181SO8-US  [SO08]  55.5,64.3 90 top
VCA2(RIGHT)  THAT2181SO8-US  [SO08]  55.5,56 90 top
Z1  BZT52C2V0T-7  [SODFL1608X65N]  59,34 270 top

## Tracks (layer width: path | path; a pad name or v marks a point on that pad's centre or on a via)
0,5V_DAC  (via drill 0.5)
  Top(V+) 0.508: R61.1 R60.2 52.5,40 v51.8,39.3 | IC7.3 37.84,8.06 39.1,6.79 IC7.5 41.15,6.05 41.3,5.9 v44.4,5.9
  Bottom 0.508: v51.8,39.3 51.8,13.3 v44.4,5.9
1V_DAC
  Top(V+) 0.254: IC2.7 62.35,22.5
  Top(V+) 0.305: 62.35,22.5 C23.1 | IC3.7 62.35,11.7 C24.1
  Top(V+) 0.508: C34.1 63.85,11.65 C24.1 62.3,11.75 62.3,18.7 62.5,18.9 67.3,18.9 67.3,24 67,24.3 C33.1 63.85,22.55 C23.1 | C32.1 62.35,28.15 | 62.35,28.15 62.35,22.5 | 62.35,28.15 R68.1 64.65,33.6 C20.1 R69.2 64.75,36.3 R61.2
2V_DAC_REF
  Top(V+) 0.508: R67.1 60.65,34.8 | 60.65,34.8 R68.2 | 60.65,34.8 60.62,34.77 Z1.1
+3V3_STM32  (via drill 0.5)
  Top(V+) 0.406: R1.2 100.4,56.85 100.4,85 103.8,88.4 111.9,88.4 132.3,68 163.9,68 v164,68.1
  midBottom(V-) 0.406: v164,68.1 169.7,68.1 170.2,67.6 170.2,25.6 169.5,24.9 167.12,24.9 U1.CN11_16
+5V_STM32  (via drill 0.5)
  Top(V+) 0.2: C43.1 59.3,14.65 58.6,15.35 58.6,17.6 59,18 v59.5,18
  Top(V+) 0.254: IC3.1 55.3,15 55.3,15.4 C44.1
  Top(V+) 0.305: IC2.1 55.3,25.75 55.3,26.4 C31.1
  Top(V+) 0.406: C19.1 59.4,25.75 v58,25.75 55.3,25.75 | C43.1 59.15,15 55.3,15
  pour midTop(AGND): 53.1,31.9 53.1,-1.6 173.7,-1.6 173.7,108.6 100.9,108.6 100.9,48.2 91.7,48.2 91.7,6.7 60.8,6.7 60.8,31.9
+12V  (via drill 0.5)
  Top(V+) 0.406: U2.3 C70.1 136.95,3.85 140.25,7.15 158.35,7.15 161.4,4.1 169.9,4.1 170.4,4.6 170.4,34.3 | 165.29,35 161.5,35 160.73,34.23 U1.CN8_15 | 170.4,34.3 169.7,35 165.29,35 | 170.4,34.3 170.4,96.7 170.2,96.9 163.3,96.9 155.34,88.94 U12.9
  Top(V+) 0.508: LED2.2 10.8,72.42 K2.1 12.18,73.38 v12.2,73.4 | LED4.2 36.1,72.42 K3.1 35.17,73.4 v38,73.4 | LED1.2 60.4,72.52 K1.1 61.78,73.38 v61.8,73.4 | LED3.2 85.8,72.42 K4.1 87.38,73.38 v87.4,73.4 | K5.1 85.8,48.22 LED5.2 v87.6,46.7 | LED6.2 10.8,54.77 K6.1 12.13,55.73 v12.2,55.8 | LED7.2 23.4,54.77 K7.1 24.67,55.73 v24.7,55.7 | LED8.2 36.2,54.77 K8.1 35.27,55.7 v37.7,55.7 | v99.6,96.5 146.6,96.5 U12.9 | 165.29,35
  midBottom(V-) 0.508: v37.7,55.7 v24.7,55.7 24.6,55.8 v12.2,55.8 v12.2,73.4 v38,73.4 v61.8,73.4 v87.4,73.4 99.6,73.4 100.4,74.2 | v99.6,96.5 100.4,95.7 100.4,74.2 | 100.4,74.2 100.4,54.2 98.3,52.1 76,52.1 75.4,51.5 75.4,45.4 75.9,44.9 87.7,44.9 88.2,45.4 88.2,46.1 v87.6,46.7
.  (via drill 0.5)
  Top(V+) 0.508: IC7.7 43.09,9.34 R72.2 v43.1,11.1 | v42.95,40.25 42,40.25 R59.2
  midBottom(V-) 0.508: v43.1,11.1 43.1,21.27 43.05,21.33 43.05,40.25 v42.95,40.25
...  (via drill 0.5)
  Top(V+) 0.508: IC7.1 33.76,10.61 R71.2 33.8,10.65 v33.8,11.9 | v43.1,48.2 R73.2
  midBottom(V-) 0.508: v33.8,11.9 35.8,13.9 41.6,13.9 42,14.3 42,47.1 v43.1,48.2
ADC1-IN0  (via drill 0.5)
  Top(V+) 0.254: R4.2 R3.1 95.75,61.55 v96.8,62.6
  Bottom 0.254: v96.8,62.6 96.87,62.6 97.18,62.92
  Bottom 0.406: 97.18,62.92 116.02,62.92 116.1,63 169.1,63 169.9,62.2 169.9,40.5 169.56,40.16 166.88,40.16 165.81,39.08 U1.CN11_28
ADC1-IN3  (via drill 0.5)
  Top(V+) 0.254: R2.2 R1.1 v94.2,53.9
  Bottom 0.254: v94.2,53.9 94.2,58.8 97.6,62.2
  Bottom 0.406: 97.6,62.2 101.6,62.2 103.4,60.4 118.5,60.4 118.5,54.3 117,52.8 108.66,52.8 U1.CN12_37
AGND  (via drill 0.5)
  Top(V+) 0.254: R4.1 v98.7,60.2 | C22.2 v98.7,64.5
  Top(V+) 0.305: R6.1 R15.1 R16.1 R23.1 R24.1 | R24.1 R25.1 R26.1 R27.1 | R24.1 78.05,25.9 77.06,26.89 U3.G6 | R39.1 v43.7,34.3 | R42.1 v43.7,30.1 | R45.1 v43.7,25.9 | R65.1 43.7,21.7 v43.7,21.6
  Top(V+) 0.406: OUT_LEFT.3 42.06,86.36 v42.1,86.4 | C12.2 38.6,80.55 | 40.65,75.25 v40.6,75.2 | TP04.P$1 CONN3.1 21.89,7.7 10.1,7.7 LED9.1 10,8.8 9.9,8.9 7.7,8.9 5.6,6.8 3.11,6.8 2.31,7.6 2.31,12.01 3,12.7 5,12.7 5.35,12.35 R14.2
  Top(V+) 0.508: OUT_RIGHT.3 17.57,82.77 v17.5,82.7 | C14.2 v14.2,81.5 | C13.2 16.15,75.35 v16.1,75.3 | 38.6,80.55 v38.6,82 | C11.2 40.65,75.25 | IN_LEFT.1 v88.9,82.1 | C1.2 98.5,83 v99.3,83.8 | C3.2 73.7,83.23 v74.14,83.66 | IN_RIGHT.1 v64,81.81 v64,81.8 | C4.2 v63.8,75.1 | C2.2 v88.6,75 | C6.2 88.12,67.62 | 88.12,67.62 88.8,66.95 C21.2 | 88.12,67.62 88.23,67.73 v88.7,67.73 U4.2 | C26.2 v75.15,65.85 75.25,65.75 C5.2 | U6.1 64,69 v63.9,68.9 C25.2 | v47.6,59.8 C60.2 | C62.2 48.7,63.6 | 48.7,63.6 v47.6,63.6 | C63.2 v47.6,68.1 | C61.2 48.8,55.2 | 48.8,55.2 v47.6,55.2 | 48.8,55.2 50.23,56.63 VCA2(RIGHT).6 VCA2(RIGHT).3 | 48.7,63.6 50.03,64.94 VCA1(LEFT).6 VCA1(LEFT).3 | IC8.3 54.53,46.37 v55.35,45.55 55.8,45.09 IC8.5 | C54.2 v47.8,45.5 | C53.2 v63.4,48.7 | STAGE(RIGHT).3 STAGE(RIGHT).6 25.59,38.73 25.25,38.4 C46.2 v23.5,37.5 | STAGE(LEFT).3 STAGE(LEFT).6 25.68,46.84 25.15,46.3 C47.2 v23.4,45.5 | C48.2 v23.5,50 | C45.2 v23.5,41.9 | IC5.3 30.54,29.27 v31.8,28 IC5.5 | C36.2 v23.8,28 | C30.2 3.25,34.7 v4.3,34.7 | C28.2 13.35,34.5 v14.1,34.5 | C8.2 v12.8,31.5 | U7.2 7.96,37.47 v7.9,37.4 | v17.1,42 C29.2 | C27.2 v7.5,42 | C7.2 v24.4,24.7 | U8.1 v19.6,35 | R35.1 62.45,8.6 62.45,9.9 C24.2 v63.6,9.95 65.55,9.95 C34.2 | C23.2 v63.7,20.85 65.55,20.85 C33.2 | C32.2 66.45,29.15 v66.45,32 C20.2 R69.1 66.4,35.75 66.4,35.9 67.4,36.9 67.4,39.35 66.75,40 R60.1 | TP16.P$1 56.02,34 56.8,33.23 Z1.2 | C40.2 v37,16.3 | C39.2 v37,22.2 | C57.2 v27,17.8 | C58.2 27,24.6 v26.9,24.7 | C35.2 38.9,31.8 v39,31.9 | R46.1 v43.1,50.3 | R58.1 v42.95,42.5 | C49.2 v38.2,12.2 | C50.2 v38.6,5.2 | R47.1 R76.1 R65.1
  pour midTop(AGND): 91.1,7.5 61.5,7.5 61.5,32.7 52.5,32.7 52.5,-1.7 -1,-1.7 -1,108.4 100,108.4 100,49 91.1,49
BOTTOM
  pour Bottom: -1.7,-2.6 -1.7,109.2 174.4,109.2 174.4,-2.6
BUSY
  Top(V+) 0.406: U3.BUSY 97.61,18 99.9,18 102.9,21 102.9,23.9 103.9,24.9 109.3,24.9 109.8,25.4 109.8,27.3 111.2,28.7 116.1,28.7 118.05,30.65 126.69,30.65 153.94,57.9 163.06,57.9 164.31,59.15 U1.CN11_44
CHASIS  (via drill 0.5)
  Top(V+) 0.406: C15.1 67.8,85.15 v67.8,88 | C18.1 92.75,87.85 v92.6,88
  Top(V+) 1.016: R77.1 50.3,7.9 48.9,6.5 TP03.P$1
  Bottom 1.016: 82.69,88 v92.6,88 | 82.69,88 73.89,96.8 40.2,96.8 OUT2(L/M).G OUT1(R/S).G 5.4,94.8 1.5,90.9 1.5,55.6 6.11,50.99 6.11,45.81 1.9,41.6 1.9,12.6 11.6,2.9 46.8,2.9 TP03.P$1 | 82.69,88 v67.8,88
CS  (via drill 0.5)
  Top(V+) 0.406: U3.CS 100.53,16.73 103.6,19.8 109.3,19.8 110.6,21.1 110.6,25.3 111.4,26.1 115.7,26.1 119.34,29.74 127.14,29.74 152.7,55.3 162.2,55.3 163.1,56.2 v163.1,57
  Bottom 0.406: v163.1,57 163.1,59 164.46,60.36 167.08,60.36 168.35,61.64 U1.CN11_45
CS_DAC1  (via drill 0.5)
  Top(V+) 0.254: IC2.9 57.9,23.5 v57.3,24.1
  midBottom(V-) 0.305: v57.3,24.1 58,23.4 58,21.3 56.7,20 56.7,6.39 58.39,4.7
  midBottom(V-) 0.406: 58.39,4.7 93.01,4.7 93.88,5.57 93.88,11.98 94.9,13 99.5,13 102.7,16.2 102.7,31.8 103.4,32.5 109.9,32.5 110.8,33.4 110.8,41.4 109.6,42.6 103.4,42.6 102.9,42.1 102.9,40.5 103.3,40.1 106.4,40.1 107.39,39.11 U1.CN12_27
CS_DAC2  (via drill 0.5)
  Top(V+) 0.254: IC3.9 57.8,12.7 v57.4,13.1
  midBottom(V-) 0.305: v57.4,13.1 57.4,7 59,5.4
  midBottom(V-) 0.406: U1.CN12_29 109.13,41.37 109.6,40.9 109.6,35.9 108.8,35.1 103.8,35.1 101.6,32.9 101.6,17.6 99.5,15.5 93.9,15.5 92.9,14.5 92.9,5.9 92.4,5.4 59,5.4
CV_A_B
  Bottom 0.406: U1.CN11_3 168.35,8.55 167.3,9.6 163.7,9.6 159.91,13.39 111.01,13.39 109.7,14.7 101.54,14.7 99.81,12.96 97.65,12.96 U3.CVB U3.CVA
DAC2_OUT1(OFFSET_VCA1)  (via drill 0.5)
  Top(V+) 0.508: R76.2 R74.2 48.2,19.75 v48.2,21 | C39.1 v40.4,22.3 | v26.9,20.1 26.43,20.57 IC9.3
  Bottom 0.508: v48.2,21 46.95,22.25 40.45,22.25 v40.4,22.3 38.2,20.1 v26.9,20.1
DAC2_OUT2(OFFSET_VCA2)  (via drill 0.5)
  Top(V+) 0.508: R47.2 R75.2 48.1,17.45 v48.1,15.8 | v40.4,16.5 C40.1 38.8,19.9 35.6,19.9 34.99,19.3 IC9.5
  Bottom 0.508: v40.4,16.5 40.5,16.6 47.3,16.6 v48.1,15.8
DAC2_OUT3
  Top(V+) 0.254: IC3.4 45.8,11.7 43.9,13.6 34.65,13.6 R62.1
DAC2_OUT4
  Top(V+) 0.254: IC3.5 45.75,11.2 45.3,10.75 R70.1
DAC_OUT1  (via drill 0.5)
  Top(V+) 0.508: R57.1 18.25,23.05 v18.2,23
  midBottom(V-) 0.406: v18.2,23 18.2,20.2 27.5,10.9 27.5,3.8 29.6,1.7 116.1,1.7 157.1,42.7 164.6,42.7 U1.CN11_32
DAC_OUT2  (via drill 0.5)
  Top(V+) 0.508: R55.1 34.85,22.25 v34.9,22.3
  midTop(AGND) 0.406: v110.3,5.8 110.3,17.6 109.39,18.51 U1.CN12_11
  midBottom(V-) 0.406: v34.9,22.3 34.9,16.7 29.1,10.9 29.1,3.9 30.1,2.9 107.5,2.9 110.3,5.7 v110.3,5.8
DB0
  midBottom(V-) 0.406: U3.DB0 97.57,20.5 94.8,20.5 94.2,21.1 94.2,42.94 97.51,46.25 102.05,46.25 102.7,46.9 102.7,83.5 103.75,84.55 U1.CN12_64 105.41,84.55 106.69,83.27 109.63,83.27 115.01,77.89 U1.CN10_33
DB1
  midBottom(V-) 0.406: U3.DB1 97.6,23.07 97.6,43.1 99.7,45.2 126.6,45.2 164.7,83.3 167.06,83.3 U1.CN11_61
DB2
  midTop(AGND) 0.406: U3.DB2 101.25,24.35 102.2,25.3 102.2,26.9 102.69,27.39 108.89,27.39 109.67,28.16 109.67,31.77 110.2,32.3 117,32.3 117,63.7 116.47,64.23 U1.CN10_25 145.53,64.23 155.69,54.07 U1.CN9_14
DB3
  Top(V+) 0.406: U3.DB3 97.59,25.6 99.9,25.6 100.7,26.4 100.7,28.7 101.9,29.9 108.6,29.9 109.1,30.4 109.1,31.6 109.8,32.3 124.3,32.3 156.3,64.3 158.12,64.3 U1.CN9_22 159.46,65.5 167.08,65.5 U1.CN11_47
DB4
  Bottom 0.406: U3.DB4 102.01,26.89 104,24.9 109.1,24.9 110.6,26.4 110.6,28.1 111.24,28.74 116.14,28.74 117.94,30.54 126.54,30.54 152.6,56.6 U1.CN9_16
DB5
  Bottom 0.406: U3.DB5 96.34,26.9 97.56,28.12 102.5,28.12 103.18,27.44 109.04,27.44 109.8,28.2 109.8,30.5 110.75,31.45 126.09,31.45 153.79,59.15 U1.CN9_18
DB6
  midBottom(V-) 0.406: U1.CN9_20 159.5,63 162.8,63 162.8,79.8 165.01,82.01 U1.CN11_62
  Bottom 0.406: U3.DB6 98.93,29.43 99.4,29.9 108.5,29.9 109,30.4 109,31.8 109.6,32.4 125.8,32.4 155.1,61.7 U1.CN9_20
DB7
  Bottom 0.406: U3.DB7 97.51,30.6 100.2,30.6 101.3,31.7 101.3,59.4 104.6,59.4 U1.CN12_44 106.1,57.9 111.18,57.9 U1.CN10_20
DB8
  midTop(AGND) 0.406: U3.DB8 102.9,35.99 102.9,55.3 111.24,55.3 U1.CN10_18
DB9  (via drill 0.5)
  Top(V+) 0.406: U3.DB9 97.57,33.2 100.4,33.2 101,33.8 101,36.4 102.2,37.6 111.16,37.6 U1.CN10_4 112.47,36.47 113.6,37.6 117.6,37.6 118.7,38.7 v118.7,47.1
  midBottom(V-) 0.406: U1.CN12_52 105.29,69.31 106.6,68 115.8,68 118.6,65.2 118.6,47.2 v118.7,47.1
DB10
  midTop(AGND) 0.406: U3.DB10 102,37.63 102,65.51 106.11,65.51 U1.CN12_47 109.83,64.23 112.37,61.69 U1.CN10_24
DB11
  Top(V+) 0.406: U1.CN10_6 112.47,38.84 111.16,40.16 101.56,40.16 101.1,39.7 101.1,37.4 99.44,35.74 97.57,35.74 U3.DB11
DB12
  midTop(AGND) 0.406: U3.DB12 101.3,39.47 101.3,68.1 106.06,68.1 107.28,66.88 | 107.28,66.88 U1.CN12_49 | U1.CN10_26 109.82,66.88 107.28,66.88
DB13
  Top(V+) 0.406: U3.DB13 97.55,38.26 99.31,38.26 100.3,39.26 100.3,44.7 100.84,45.24 111.14,45.24 U1.CN10_10 112.47,44.06 113.64,45.24 116.94,45.24 117.8,46.1 117.8,74.3 115.7,76.4 109.4,76.4 U1.CN12_55
DB14
  Top(V+) 0.406: U3.DB14 98.88,44.79 102.05,47.96 102.05,69.9 102.69,70.54 106.16,70.54 U1.CN12_51 107.45,69.37 109.87,69.37 U1.CN10_28
DB15
  Top(V+) 0.406: U3.DB15 96.34,43.39 101.4,48.45 101.4,71.6 102.98,73.18 106.06,73.18 U1.CN12_53
DGND
  pour Top(V+): 53.1,31.9 53.1,-1.2 173.4,-1.2 173.4,108.6 100.9,108.6 100.9,48.2 91.7,48.2 91.7,6.6 61.1,6.6 61.1,31.9
  pour midBottom(V-): 53,31.9 53,-2.1 174.1,-2.1 174.1,108.6 100.9,108.6 100.9,48.2 91.7,48.2 91.7,6.6 60.8,6.6 60.8,31.9
DIN_DAC  (via drill 0.5)
  Top(V+) 0.254: IC3.8 58.4,12.2 56.1,9.9 v56.1,9.8
  Top(V+) 0.305: IC2.8 57.8,23 v57.2,22.4
  midBottom(V-) 0.305: v57.2,22.4 56.1,21.3 v56.1,9.8 56.1,5.7 57.8,4
  midBottom(V-) 0.406: 57.8,4 93.6,4 94.8,5.2 94.8,10.1 95,10.3 99.5,10.3 103.9,14.7 109.8,14.7 110.8,15.7 110.8,17.8 111.5,18.5 129.7,18.5 156.4,45.2 160.1,45.2 160.73,44.57 U1.CN9_5
E+_OUT_STAGE_LEFT
  Top(V+) 0.508: STAGE(LEFT).2 37.77,45.56 38.3,46.1 TP02.P$1 40.05,48.8 40.15,48.9 | R46.2 40.15,48.9 | 40.15,48.9 R73.1
E+_OUT_STAGE_RIGHT
  Top(V+) 0.508: STAGE(RIGHT).2 37.27,37.47 38.2,38.4 TP01.P$1 39.95,41 40.15,41.2 | R58.2 40.15,41.2 | 40.15,41.2 R59.1
EC+_VCA1(LFT)  (via drill 0.5)
  Top(V+) 0.508: VCA1(LEFT).2 60.06,63.66 60.85,64.45 TP37.P$1 60.85,68.55 60,69.4 v45,69.4 | R56.2 24.09,23.05 IC9.1 26.2,23.11 v27.4,21.9
  Bottom 0.508: v27.4,21.9 30.5,21.9 33.19,24.59 33.19,48.19 43.7,58.7 43.7,68.1 v45,69.4
EC+_VCA2(RIGHT)  (via drill 0.5)
  Top(V+) 0.508: VCA2(RIGHT).2 59.97,55.37 60.85,56.25 TP36.P$1 57.95,60.8 v45.5,60.8 | IC9.7 31.39,21.84 R54.2 33.15,23.6 v34.2,23.6
  Bottom 0.508: v34.2,23.6 34.2,47.7 44.7,58.2 44.7,60.4 45.1,60.8 v45.5,60.8
FRST
  Top(V+) 0.406: U3.FRST 97.67,20.6 100.4,20.6 101.6,21.8 101.6,26 103,27.4 108.5,27.4 109.9,28.8 109.9,30.7 110.7,31.5 126,31.5 154.88,60.38 167.62,60.38 168.35,59.65 U1.CN11_43
L  (via drill 0.5)
  Top(V+) 0.508: IN_LEFT.6 IN_LEFT.5 96.2,72.9 95.3,72 90.92,72 88.77,69.85 82.92,69.85 82.4,69.33 v82.4,68.3 82.45,68.3 82.45,67.33 82.64,67.14 IC4.3 | v82.4,54.3 84.9,54.3 K5.Q1
  Bottom 0.508: v82.4,68.3 v82.4,54.3
L/M_IN(VCA1_IN)
  Top(V+) 0.508: C67.1 71.8,60.7 74.4,58.1 80.7,58.1 82,56.8 K5.P1 88,56.8 90.2,54.6 90.2,42.55 87.25,39.6 R5.1
L/M_OUT(OUT_STAGE_LEFT)  (via drill 0.5)
  Top(V+) 0.305: R19.1 88.3,25.9 90.3,23.9 90.3,13.7 88.1,11.5 71.5,11.5 68.3,14.7 68.3,40.4 67.4,41.3 47.4,41.3 40.1,34 28.7,34 26.8,32.1 R28.2
  Top(V+) 0.508: IC5.1 27.36,31.8 R28.2 C37.2 23.95,31.25 | IC1.3 18.86,29.54 19.3,29.1 21.8,29.1 23.95,31.25 | 23.95,31.25 22.4,32.8 v22.4,35.3 | v9.8,59.2 9.8,60.86 K6.Q1
  Bottom 0.508: v22.4,35.3 15.4,42.3 15.4,59.2 v9.8,59.2
L/M_OUT(VCA1_OUT)  (via drill 0.5)
  Top(V+) 0.508: 52.5,48.91 50.76,48.91 R48.2 C55.2 48.6,48.85 45.55,48.85 43.9,47.2 43.9,45.5 42.7,44.3 R36.1 | 52.5,48.91 IC8.1 | R17.1 86.55,32.8 88.5,34.75 v88.5,37.9 | v52.6,50.1 52.6,49.01 52.5,48.91
  Bottom 0.508: v88.5,37.9 88.5,41.2 86.6,43.1 54.1,43.1 52.6,44.6 v52.6,50.1
L/M_OUT+
  Top(V+) 0.508: K3.S1 36.66,83.64 37.4,82.9 37.4,75.6 39,74 44.6,74 OUT_LEFT.8 | OUT_LEFT.8 OUT_LEFT.7 | OUT_LEFT.8
L/M_OUT-
  Top(V+) 0.508: K3.S2 30.14,83.64 33.9,87.4 44,87.4 44,84.6 | OUT_LEFT.2 44,84.6 | 44,84.6 OUT_LEFT.1
M
  Top(V+) 0.508: U4.5 U4.6 96.3,63.52 92.12,59.34 K5.S1
M1  (via drill 0.5)
  Top(V+) 0.508: U7.6 U7.5 v4.6,42.4 | K6.S1 7.99,65.99 v7.6,65.6
  Bottom 0.508: v7.6,65.6 8.8,64.4 8.8,44.5 6.7,42.4 v4.6,42.4
N$1
  Top(V+) 0.406: C9.1 63.05,81.25 63.77,80.53 IN_RIGHT.2
  Top(V+) 0.508: C9.1 63.05,83.64 K1.S1
N$2
  Top(V+) 0.508: K1.S2 53.36,83.64 57.2,79.8 63,79.8 63.53,79.27 IN_RIGHT.3 68.3,79.27 68.3,81.3 69.9,82.9 72.03,82.9 73.45,84.33 73.45,84.6 C10.2
N$3
  Top(V+) 0.406: C9.2 66.35,83.5 69.2,83.5 69.55,83.85 C15.2 C10.1
N$4  (via drill 0.5)
  Top(V+) 0.305: U3.V1 72.24,39.59 73.59,40.94 75.51,40.94 76.5,39.95 76.5,38.65 v76.35,38.5 | v83.1,38 83.1,38.95 | 83.1,38.95 R5.2 | 83.1,38.95 82.45,39.6 R6.2
  Bottom 0.305: v76.35,38.5 82.6,38.5 v83.1,38
N$5
  Top(V+) 0.508: K8.Q1 33.13,60.91 30.23,58 29.1,58 26,58 24.4,59.6 19.97,59.6 18.99,60.58 18.99,66 | 18.99,66 22.43,66 K7.S1 | 18.99,66 18.99,66.01 17.55,67.45 8.05,67.45 6.6,66 6.6,64.1 7.25,63.45 K6.P1
N$6  (via drill 0.5)
  Top(V+) 0.305: U3.V2 71.34,37.05 70.96,37.43 70.96,40.25 72.36,41.65 75.9,41.65 77.2,40.34 77.2,34.95 v77.06,34.8 | v83.1,34.4 83.1,35.75 | 83.1,35.75 83.05,35.7 R15.2 | 83.1,35.75 R13.2
  Bottom 0.305: v77.06,34.8 82.7,34.8 v83.1,34.4
N$7
  Top(V+) 0.508: K4.S2 79.78,83.64 80.4,83.02 80.4,80.7 81.21,79.89 88.51,79.89 88.9,79.5 90.94,79.5 IN_LEFT.3 93.06,79.56 93.9,80.4 93.9,82.5 95,83.6 97.33,83.6 98.65,84.92 C17.2
N$8  (via drill 0.5)
  Top(V+) 0.508: K2.Q1 7.66,78.56 v6.7,77.6 | v59.25,76.45 59.25,78.26 K1.Q1
  Bottom 0.508: v6.7,77.6 14.9,77.6 58.2,77.6 59.3,76.5 v59.25,76.45
N$9
  Top(V+) 0.406: C17.1 C18.2 94.45,84.3 94.25,84.1 91.95,84.1 90.95,85.1 C16.2
N$10  (via drill 0.5)
  Top(V+) 0.305: U3.V3 70.84,34.51 70.35,34.99 70.35,40.64 72.06,42.35 76.39,42.35 77.91,40.84 77.91,31.45 v77.76,31.3 | v83.1,30.9 83.1,32.05 | 83.1,32.05 83.1,32.15 R17.2 | 83.1,32.05 R16.2
  Bottom 0.305: v77.76,31.3 82.7,31.3 v83.1,30.9
N$11  (via drill 0.5)
  Top(V+) 0.508: K2.Q2 4.51,76.6 v9.8,76.6 | v52,76.6 52,78.3 K1.Q2
  Bottom 0.508: v9.8,76.6 v52,76.6
N$12  (via drill 0.5)
  Top(V+) 0.305: U3.V4 70.98,31.97 69.65,33.3 69.65,40.93 71.77,43.06 76.99,43.06 78.61,41.43 78.61,28.21 v78.3,27.9 | v83.1,27.5 83.1,28.75 | 83.1,28.75 R18.2 | 83.1,28.75 82.45,29.4 R23.2
  Bottom 0.305: v78.3,27.9 82.7,27.9 v83.1,27.5
N$13
  Top(V+) 0.406: C16.1 88.05,85.1 87.95,85 87.95,81.35 88.5,80.8 90.97,80.8 IN_LEFT.2
  Top(V+) 0.508: C16.1 85.2,85.1 84.84,84.75 K4.S1
N$14
  Top(V+) 0.508: LED1.1 53.25,71.3 R7.2
N$15  (via drill 0.5)
  Top(V+) 0.508: v32,81.1 K3.P1
  Bottom 0.508: OUT2(L/M).3 32,83.52 v32,81.1
N$16
  Top(V+) 0.508: R8.2 84.1,71.1 LED3.1
N$17  (via drill 0.5)
  Top(V+) 0.508: K3.P2 v30.4,81.1
  Bottom 0.508: v30.4,81.1 30.4,85.73 OUT2(L/M).2
N$18  (via drill 0.5)
  Top(V+) 0.508: U4.3 92.64,66.47 93.4,65.7 93.4,64.5 92.1,63.2 84.75,63.2 84.05,63.9 IC4.1 IC4.2 81.83,65.86 81.05,66.65 81.05,68.8 80.45,69.4 v76.6,69.4 | U6.2 66.23,67.7 v67.9,67.7
  Bottom 0.508: v76.6,69.4 69.6,69.4 v67.9,67.7
N$19
  Top(V+) 0.508: K8.S1 32.84,65.99 32.24,65.39 32.24,61.39 29.96,59.11 26.25,59.11 24.45,60.91 K7.Q1 20.39,60.91 20,61.3 20,64.1 20.66,64.75 24.29,64.75 24.69,65.15 24.69,67 24.4,67.29 19.05,67.29 17.93,68.4 7.72,68.4 5.6,66.28 5.6,64.2 4.85,63.45 K6.P2
N$20  (via drill 0.5)
  Top(V+) 0.305: U3.V5 70.94,29.43 69.65,28.14 69.65,15.87 71.77,13.74 76.59,13.74 78.3,15.46 v78.3,24.4 | v83.1,24 83.1,25.25 | 83.1,25.25 R19.2 | 83.1,25.25 82.45,25.9 R24.2
  Bottom 0.305: v83.1,24 82.7,24.4 v78.3,24.4
N$21
  Top(V+) 0.508: IN1(R/S).2 65.64,92.5 57.12,92.5 55.49,90.88 55.49,86.49 54.1,85.1 50.71,85.1 49.8,84.19 49.8,81.6 50.3,81.1 K1.P2
N$22
  Top(V+) 0.508: IN1(R/S).3 57.95,90.35 57.1,89.5 57.1,81.6 57.6,81.1 K1.P1
N$23  (via drill 0.5)
  Top(V+) 0.508: v5.6,81.1 K2.P2
  Bottom 0.508: OUT1(R/S).2 5.6,86.13 v5.6,81.1
N$24  (via drill 0.5)
  Top(V+) 0.508: v6.9,81.1 K2.P1
  Bottom 0.508: OUT1(R/S).3 6.9,83.62 v6.9,81.1
N$25
  Top(V+) 0.508: IN2(L/M).3 83.55,90.35 82.5,89.3 82.5,81.5 82.9,81.1 K4.P1
N$26
  Top(V+) 0.508: R12.2 LED8.1
N$27
  Top(V+) 0.508: IN2(L/M).2 91.14,92.7 83.2,92.7 81.4,90.9 81.4,86.4 80.2,85.2 76.1,85.2 75.2,84.3 75.2,81.8 75.9,81.1 K4.P2
N$28  (via drill 0.5)
  Top(V+) 0.508: K3.Q1 35.15,79.39 v35.4,79.65 | v84.8,76.1 84.8,78.51 K4.Q1
  Bottom 0.508: v35.4,79.65 39.25,79.65 39.3,79.7 73.3,79.7 76.9,76.1 v84.8,76.1
N$29
  Top(V+) 0.508: R11.2 LED7.1
N$30
  Top(V+) 0.508: R10.2 LED6.1
N$31  (via drill 0.5)
  Top(V+) 0.508: K3.Q2 31.45,78.56 v31.5,78.6 | K4.Q2 77.5,78.5 v77.5,77.1
  Bottom 0.508: v31.5,78.6 33.6,80.7 73.9,80.7 v77.5,77.1
N$32
  Top(V+) 0.508: R9.2 LED5.1
N$33  (via drill 0.5)
  Top(V+) 0.508: IC4.7 IC4.6 | U4.1 93.19,69 94.31,67.89 94.31,63.91 92.69,62.29 84.11,62.29 80.53,65.86 IC4.7 | IC4.7 78.55,67.17 76.64,67.17 v76.6,67.2 | v68.1,66.4 66.27,66.4 U6.3
  Bottom 0.508: v76.6,67.2 68.9,67.2 v68.1,66.4
N$34  (via drill 0.5)
  Top(V+) 0.305: U3.V6 70.94,26.89 70.25,26.2 70.25,16.56 72.36,14.45 75.89,14.45 77.51,16.07 77.51,20.99 v77.5,21 | v83.1,20.6 83.1,21.85 | 83.1,21.85 R20.2 | 83.1,21.85 82.45,22.5 R25.2
  Bottom 0.305: v77.5,21 82.8,21 83.1,20.7 v83.1,20.6
N$35  (via drill 0.5)
  Top(V+) 0.305: U3.V7 71.34,24.35 70.86,23.87 70.86,17.25 72.86,15.25 75.4,15.25 76.81,16.66 76.81,17.55 v76.76,17.6 | v83.1,17.2 83.1,18.45 | 83.1,18.45 R21.2 | 83.1,18.45 82.45,19.1 R26.2
  Bottom 0.305: v76.76,17.6 82.7,17.6 v83.1,17.2
N$36  (via drill 0.5)
  Top(V+) 0.305: v75.2,16.35 v75.19,16.36 72.89,16.36 71.61,17.64 71.61,21.21 U3.V8 | v83.1,13.7 83.1,14.85 | 83.1,14.85 R22.2 | 83.1,14.85 82.45,15.5 R27.2
  Bottom 0.305: v75.2,16.35 75.2,14.75 75.95,14 82.9,14 83.1,13.8 v83.1,13.7
N$43
  Top(V+) 0.508: IC1.7 IC1.6 18.85,26.53 18.85,25.53 18.47,25.15 17.02,25.15 16.64,25.53 16.64,29.46 16.1,30 11.6,30 11.6,32.99 | U7.1 9.8,34.8 11.6,32.99 | U8.3 17.7,38.73 17.7,35 16,33.3 11.6,33.3 11.6,32.99
N$45  (via drill 0.5)
  Top(V+) 0.508: IC1.2 IC1.1 v21.41,34.3 21.41,37.12 21.07,37.45 19.62,37.45 U8.2 | v7.8,38.8 9.73,38.8 U7.3
  Bottom 0.508: v21.41,34.3 20.41,33.3 10.1,33.3 10.1,38.1 9.4,38.8 v7.8,38.8
N$48  (via drill 0.5)
  Top(V+) 0.508: STAGE(LEFT).8 30.61,44.3 v30.9,44 | v30.7,30.5 28.89,30.5 IC5.2 28.06,30.54 27.07,29.55 R28.1 25.5,29.55 C37.1
  Bottom 0.508: v30.9,44 30.9,30.7 v30.7,30.5
N$49
  Top(V+) 0.508: LED2.1 R33.2
N$50
  Top(V+) 0.406: R14.1 3.65,8.05
  Top(V+) 0.508: 3.65,8.05 LED10.2
N$51
  Top(V+) 0.508: LED4.1 R34.2
N$52
  Top(V+) 0.406: R29.1 8.35,12.35 7,13.7 2.3,13.7 1.3,12.7 1.3,7.4 2.7,6 7.4,6 8.4,7 LED9.2
N$53  (via drill 0.5)
  Top(V+) 0.508: STAGE(RIGHT).8 v32,36.2 | v32.3,29.3 34.31,29.3 | 34.31,29.3 IC5.6 | C38.1 R30.1 36.02,28.55 35.27,29.3 34.31,29.3
  Bottom 0.508: v32,36.2 32,29.6 v32.3,29.3
N$54
  Top(V+) 0.508: C45.1 R32.2 STAGE(RIGHT).5
N$55
  Top(V+) 0.508: R36.2 STAGE(LEFT).1
N$56
  Top(V+) 0.254: R38.2 51.5,34.75 51.5,25.68 51.91,25.28 51.91,24.03 52.47,23.47 55.3,23.47 IC2.2
N$57
  Top(V+) 0.254: R41.2 50.35,32.2 50.8,31.75 50.8,25.34 51.25,24.89 51.25,23.55 51.78,23.02 55.28,23.02 IC2.3
N$58
  Top(V+) 0.254: R44.2 49.85,25.25 50.6,24.5 50.7,24.4 50.7,23 51.2,22.5 IC2.4
N$59
  Top(V+) 0.254: IC2.5 50.9,22 49.85,23.05 R64.2
N$60
  Top(V+) 0.254: IC3.2 51.6,12.7 50.8,13.5 50.8,19.6 R74.1
N$61
  Top(V+) 0.254: IC3.3 51.2,12.2 49.85,13.55 49.85,17.5 R75.1
N$63
  Top(V+) 0.508: R57.2 R56.1 22.29,21.84 IC9.2
N$64  (via drill 0.5)
  Top(V+) 0.508: C55.1 R48.1 51.15,47.05 51.73,47.63 IC8.2 54.23,47.63 v54.3,47.7 | VCA1(LEFT).8 v54.49,62.4 v54.5,62.4
  Bottom 0.508: v54.5,62.4 54.9,62 54.9,48.3 v54.3,47.7
N$65
  Top(V+) 0.508: R52.2 61.7,60.7 60,62.4 VCA1(LEFT).1
N$68
  Top(V+) 0.508: STAGE(RIGHT).1 R37.2
N$71
  Top(V+) 0.508: C67.2 R52.1
N$72
  Top(V+) 0.508: R62.2 R71.1 34.19,9.34 IC7.2
N$73
  Top(V+) 0.508: C48.1 R31.2 STAGE(LEFT).5
N$74
  Top(V+) 0.508: IC7.6 42.69,8.06 R72.1 R70.2
N$75  (via drill 0.5)
  Top(V+) 0.508: C56.1 R49.1 60.12,45.45 59.23,46.34 58.27,46.34 IC8.6 58.22,46.4 v56.4,46.4 | VCA2(RIGHT).8 v55.85,54.09 v55.85,54.1
  Bottom 0.508: v55.85,54.1 56.15,53.8 56.15,46.65 v56.4,46.4
N$77
  Top(V+) 0.508: VCA2(RIGHT).5 R51.2 C60.1
N$78
  Top(V+) 0.508: C68.2 R53.1
N$79
  Top(V+) 0.508: R53.2 61.4,55.1 60.4,54.09 VCA2(RIGHT).1
N$80
  Top(V+) 0.508: VCA1(LEFT).5 R50.2 C63.1
N$81
  Top(V+) 0.508: IC9.6 31.79,20.57 R54.1 R55.2
OS0
  Bottom 0.406: U3.OS0 100.49,6.57 101.25,5.81 U1.CN12_2
OS1
  Bottom 0.406: U3.OS1 97.57,7.8 100.4,7.8 101.06,7.14 106.12,7.14 107.39,5.86 U1.CN12_1
OS2
  Bottom 0.406: U3.OS2 99.37,9.6 110.2,9.6 111.39,8.41 116.4,8.41 117.51,7.3 162.5,7.3 163.4,6.4 163.4,5.2 164.6,4 167.9,4 168.35,4.45 U1.CN11_1
OUT1_DRIVER  (via drill 0.5)
  Top(V+) 0.508: R33.1 1.75,72.57 K2.2 2.6,73.42 v2.6,74.9 | K1.2 51.35,72.47 R7.1 47.7,71.1 v47.7,103.6 | v148.3,80.1 154.12,80.1 U12.16
  midBottom(V-) 0.508: v2.6,74.9 2.6,102.2 49.1,102.2 | 49.1,102.2 v47.7,103.6 | v148.3,80.1 146.3,82.1 146.3,98.1 142.2,102.2 49.1,102.2
OUT2_DRIVER  (via drill 0.5)
  Top(V+) 0.508: K3.2 26.95,72.47 R34.1 26.9,71.05 v26.9,69.8 | K4.2 76.75,72.57 R8.1 v75.3,71.1 | v145.72,81.33 U12.15 | U12.15 | v46.7,95.4 v46.7,71.1
  midBottom(V-) 0.508: v26.9,69.8 28.2,71.1 v46.7,71.1 v75.3,71.1 | v46.7,95.4 46.7,95.9 47.6,96.8 93,96.8 95.4,99.2 141.1,99.2 143.44,96.86 143.44,83.68 145.72,81.39 v145.72,81.33
OUT3_DRIVER  (via drill 0.5)
  Top(V+) 0.508: R9.1 76.75,48.17 K5.2 77.66,50.35 v78.2,50.9 | v143.18,82.58 154.15,82.58 U12.14
  midBottom(V-) 0.508: v78.2,50.9 98.6,50.9 101.5,53.8 101.5,96.3 103.3,98.1 140.9,98.1 142.53,96.47 142.53,83.3 143.18,82.65 v143.18,82.58
OUT4_DRIVER  (via drill 0.5)
  Top(V+) 0.508: R10.1 1.75,54.92 K6.2 2.6,55.77 v2.6,57.1 | v145.35,83.9 154.12,83.9 U12.13
  midBottom(V-) 0.508: v2.6,57.1 2.6,72.2 3.6,73.2 3.6,101.19 141.9,101.19 145.35,97.75 v145.35,83.9
OUT5_DRIVER  (via drill 0.5)
  Top(V+) 0.508: K7.2 14.25,54.82 R11.1 12.65,53.35 v12.6,53.3 | v144.39,85.1 154.12,85.1 U12.12
  midBottom(V-) 0.508: v12.6,53.3 4.5,53.3 3.6,54.2 3.6,71.7 4.6,72.7 4.6,100.2 141.6,100.2 144.39,97.41 v144.39,85.1
OUT6_DRIVER  (via drill 0.5)
  Top(V+) 0.508: K8.2 27.05,54.82 R12.1 25.55,53.35 v23.9,51.7 | v147.3,86.4 U12.11
  midBottom(V-) 0.508: v23.9,51.7 4.4,51.7 1.4,54.7 1.4,105.4 86,105.4 88.1,103.3 142.48,103.3 147.3,98.48 v147.3,86.4
OUT_L/M
  Top(V+) 0.508: OUT_LEFT.4 40.8,83.31 41.6,82.5 43.9,82.5 45.6,80.8 45.6,73.6 44.9,72.9 40.3,72.9 37.4,70 37.4,64.1 36.75,63.45 K8.P1
OUT_R/S
  Top(V+) 0.508: OUT_RIGHT.4 16.3,82.5 17.5,81.3 22.1,81.3 25.6,77.8 25.6,63.85 25.2,63.45 K7.P1
R  (via drill 0.5)
  Top(V+) 0.508: IN_RIGHT.6 71.4,78.3 IN_RIGHT.5 73.41,78 74.35,77.05 74.35,70.25 76.19,68.41 IC4.5 v80.1,68.4 | K5.Q2 80.06,54.26 v80.1,54.3
  Bottom 0.508: v80.1,68.4 v80.1,54.3
R/S_IN(VCA2_IN)  (via drill 0.5)
  Top(V+) 0.508: K5.P2 74.5,56.8 | 74.5,56.8 72.8,55.1 C68.1 | R13.1 86.15,36.4 87,37.25 v87,37.9 | v86.95,40.95 89.19,43.19 89.19,50.9 87.39,52.7 74.5,52.7 74.5,56.8
  Bottom 0.508: v87,37.9 87,40.9 v86.95,40.95
R/S_OUT(OUT_STAGE_RIGHT)  (via drill 0.5)
  Top(V+) 0.305: R20.1 87.9,22.5 89.35,21.05 89.35,14.35 87.7,12.7 71.5,12.7 69,15.2 69,40.7 67.7,42 47.1,42 39.9,34.8 v39.8,34.8
  Top(V+) 0.508: IC5.7 35.41,30.54 35.7,30.25 R30.2 C38.2 38.7,29.75 38.97,29.75 v39.35,29.37 39.35,27.73 37.52,25.9 v24.2,25.9 24.1,25.9 21.9,28.1 17.6,28.1 17.59,28.09 IC1.5 | K6.Q2 2.56,59.45 3.9,58.1 v18.6,58.1
  Bottom 0.305: v39.35,29.37 39.8,29.82 v39.8,34.8
  Bottom 0.508: v24.2,25.9 25,26.7 25,34.45 20.1,39.35 20.1,56.6 v18.6,58.1
R/S_OUT(VCA2_OUT)  (via drill 0.5)
  Top(V+) 0.508: IC8.7 59.16,47.63 59.65,47.15 R49.2 C56.2 63.17,47.15 63.7,46.62 63.7,44.4 v63.44,44.14 63.44,44.01 62.18,42.75 46.8,42.75 40.25,36.2 R37.1 | R18.1 87.55,29.4 90,31.85 v90,37.9
  Bottom 0.508: v90,37.9 90,41.7 87.56,44.14 v63.44,44.14
R/S_OUT+
  Top(V+) 0.508: K2.S1 9.98,83.5 11.92,83.5 12.4,83.02 12.4,76.1 14.5,74 20.1,74 OUT_RIGHT.8 | OUT_RIGHT.8 | OUT_RIGHT.7 OUT_RIGHT.8
R/S_OUT-
  Top(V+) 0.508: K2.S2 4.64,83.64 7.3,86.3 19.4,86.3 19.5,86.2 19.5,84.4 | 19.5,84.4 OUT_RIGHT.1 | 19.5,84.4 OUT_RIGHT.2
RANGE
  Bottom 0.406: U3.RANGE 97.63,10.4 101.1,10.4 102.8,12.1 109.7,12.1 110.9,10.9 160.72,10.9 U1.CN11_2
RD
  Top(V+) 0.406: U3.RD 97.67,15.52 101.91,15.52 102.72,14.7 110.2,14.7 111.5,13.4 159.26,13.4 164.31,8.35 U1.CN11_4
RELAIS1
  Top(V+) 0.406: U12.1 162.04,80.06 165.16,76.93 U1.CN11_58
RELAIS2
  Top(V+) 0.406: U12.2 162.3,81.33 162.94,80.68 167.14,80.68 U1.CN11_59
RELAIS3
  Top(V+) 0.406: U12.3 163.85,82.59 U1.CN11_64
RELAIS4  (via drill 0.5)
  Top(V+) 0.406: U12.4 160.68,83.9 v163.6,83.9
  Bottom 0.406: v163.6,83.9 163.6,87 163.9,87.3 165.6,87.3 U1.CN11_66
RELAIS5  (via drill 0.5)
  Top(V+) 0.406: U12.5 162.44,85.14 v162.5,85.2
  Bottom 0.406: v162.5,85.2 162.5,87.1 163.8,88.4 167.7,88.4 168.35,87.75 U1.CN11_65
RELAIS6
  Top(V+) 0.406: U12.6 162.4,86.41 162.94,85.86 167.04,85.86 U1.CN11_63
RESET
  Bottom 0.406: U3.RST 102,17.31 102,21 103.3,22.3 110,22.3 111.3,23.6 123.5,23.6 155.2,55.3 164.5,55.3 U1.CN11_42
S
  Top(V+) 0.508: U6.6 U6.5 77.26,59.34 K5.S2
S1  (via drill 0.5)
  Top(V+) 0.508: U8.6 U8.5 14.4,45.1 v7.5,45.1 | v4.8,65 3.7,66.1 2.56,66.1 K6.S2
  Bottom 0.508: v4.8,65 7.5,62.3 v7.5,45.1
SCLK_DAC  (via drill 0.5)
  Top(V+) 0.254: IC2.10 58.6,24 v58.2,24.4 | v58.1,13.7 58.6,13.2 IC3.10
  midBottom(V-) 0.305: v58.2,24.4 58.6,24 58.6,14.2 v58.1,13.7 58.1,7.5 59.5,6.1
  midBottom(V-) 0.406: 59.5,6.1 83,6.1 91.6,6.1 92.1,6.6 92.1,16.9 93.2,18 99.9,18 100.4,18.5 100.4,34.5 103.4,37.5 106.5,37.5 107.39,36.61 U1.CN12_25
SYM1  (via drill 0.5)
  Top(V+) 0.305: R39.2 R40.2 46.8,36.4
  Top(V+) 0.508: v46.8,37.8 46.8,36.4 | v57.95,67.95 58.1,67.8 VCA1(LEFT).4 | R40.2 R38.1
  Bottom 0.508: v46.8,37.8 46.45,38.15 46.45,69.8 56.2,69.8 58,68 v57.95,67.95
SYM2  (via drill 0.5)
  Top(V+) 0.305: R42.2 R43.2 48.1,32.2 R41.1
  Top(V+) 0.508: 48.1,32.2 48.1,33.5 v49.1,34.5 | v52.9,59.7 57.8,59.7 58.1,59.41 VCA2(RIGHT).4
  Bottom 0.508: v49.1,34.5 49.1,58.4 50.4,59.7 v52.9,59.7
SYM3  (via drill 0.5)
  Top(V+) 0.305: R44.1 R63.2 R45.2
  Top(V+) 0.508: R44.1 48.15,28.65 v49.2,29.7 | v36.9,46.7 36.9,47.2 35.99,48.1 STAGE(LEFT).4
  Bottom 0.508: v49.2,29.7 46.7,29.7 45.61,30.79 45.61,42.69 41.65,46.65 36.95,46.65 v36.9,46.7
SYM4  (via drill 0.5)
  Top(V+) 0.305: R65.2 R66.2 R64.1
  Top(V+) 0.508: R64.1 48.15,24.95 v49.1,25.9 | v36.8,38.7 36.8,39.2 35.99,40.01 STAGE(RIGHT).4
  Bottom 0.508: v49.1,25.9 44.7,30.3 44.7,37.2 43.2,38.7 v36.8,38.7
V+
  Top(V+) 0.406: OUT_RIGHT.6 17.6,79.17 C13.1 | 42.1,79.36 OUT_LEFT.6 | U2.1 130.42,2.7 C69.1 128.65,3.95 127.8,4.8 125.8,4.8 125,4 125,2.5 124.8,2.3 23,2.3
  Top(V+) 0.508: C11.1 42.1,79.36 | C3.1 73.69,80.53 IN_RIGHT.7 | C1.1 96.22,80.85 IN_LEFT.7 | U4.7 96.31,67.75 98.5,67.75 C22.1 | U6.7 73.52,67.73 C26.1 | C5.1 IC4.8 | VCA1(LEFT).7 52.84,63.6 C62.1 | VCA2(RIGHT).7 51.02,55.37 C61.1 | IC8.8 60.05,48.91 C53.1 | C47.1 26.91,45.56 STAGE(LEFT).7 | C46.1 28.96,37.5 STAGE(RIGHT).7 | IC5.8 C35.1 | IC1.8 21.41,24.75 C7.1 | C28.1 14.38,37.45 U8.7 | C30.1 2.42,37.47 U7.7 | IC9.8 29.65,24.5 C58.1 | IC7.8 41.15,12.1 C49.1 | 23,2.3 19.91,5.39 CONN3.2
  pour Top(V+): 52.4,32.7 52.4,-1.3 -0.6,-1.3 -0.6,108.2 100,108.2 100,49 91.1,49 91.1,7.5 61.5,7.5 61.5,32.7
V-  (via drill 0.5)
  Top(V+) 0.254: R2.1 98.6,56 v98.7,56.1
  Top(V+) 0.305: R40.1 v43.7,36.4 | R43.1 v43.7,32.2 | R63.1 v43.7,28 | R66.1 v43.7,23.8
  Top(V+) 0.406: LED10.1 6.9,9.7 14.7,9.7 14.7,11.4 TP23.P$1
  Top(V+) 0.508: C14.1 v15.3,78.55 15.64,78.55 OUT_RIGHT.5 | OUT_LEFT.5 40.15,78.75 v39.7,78.75 C12.1 | IN_RIGHT.4 66.16,77.95 C4.1 65.8,77.95 v65.8,76.1 | C2.1 88.64,78.3 IN_LEFT.4 v91,76.6 | IC4.4 C6.1 85.65,67.05 v85.6,67 | v87,64.8 87.05,64.75 C21.1 90.66,64.75 U4.4 | U6.4 64.34,65.19 C25.1 v63.9,63.5 | R51.1 v47.6,57.9 | R50.1 v47.6,66.2 | IC8.4 51.35,45.09 | 51.35,45.09 C54.1 | 51.35,45.09 51.35,43.95 v51.4,43.9 | R31.1 v23.4,48.1 | R32.1 v23.5,40 | C36.1 28,28 | 28,28 IC5.4 | C8.1 17.05,31.5 IC1.4 17.59,33.49 v18.4,34.3 | C29.1 20.15,40.55 U8.4 v21.59,40.01 v21.6,40 | U7.4 10.55,40.76 C27.1 v11.7,42 | 28,28 28.9,27.1 v28.9,26.9 | C57.1 IC9.4 24.15,16.15 v24.1,16.1 | IC7.4 C50.1 35.55,5.3 v34.3,5.3
  pour midBottom(V-): 100,108.4 100,48.9 91,48.9 91,7.5 61.5,7.5 61.5,32.7 52.5,32.7 52.5,-2.1 -1.4,-2.1 -1.4,108.4

## Text on the board
tNames: AGND | quantum | AnalougeEngine / V4_0 | -15V | +15V | -15V | AGND | +15V | DGND | bottom | CHASIS